# EAGLE board Mainboard v13 (EAGLE 9.4.2)
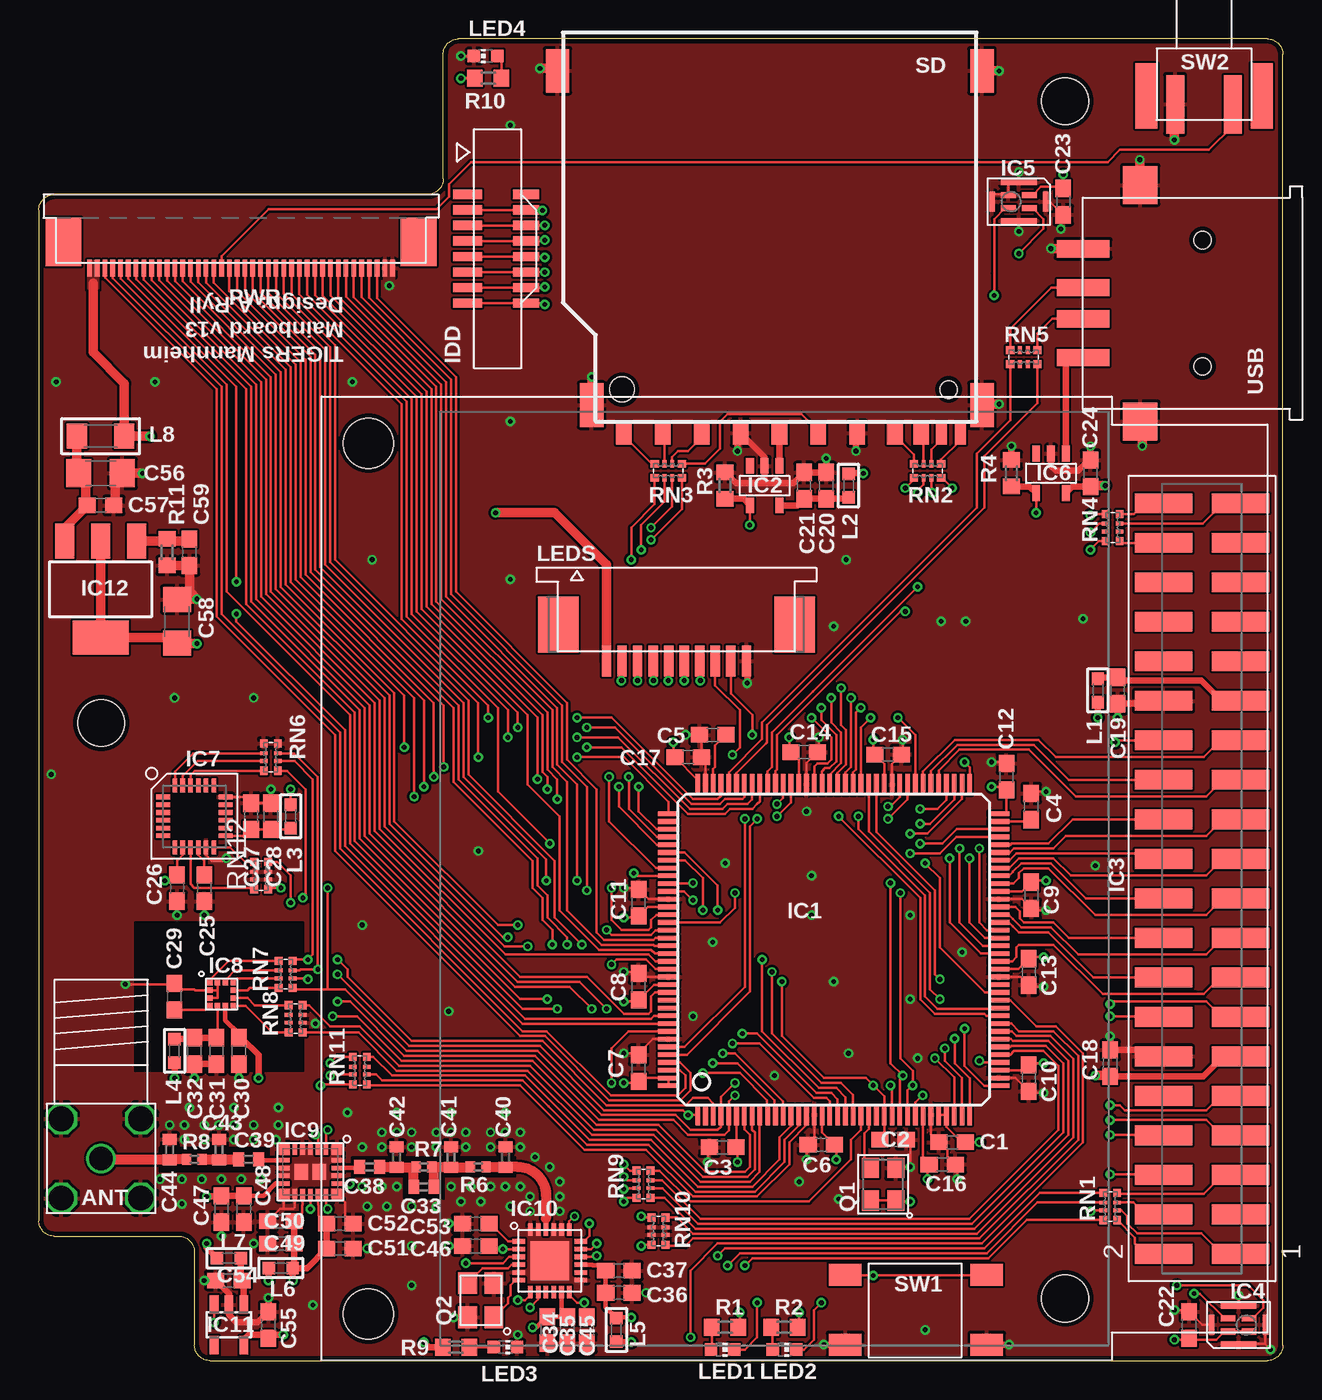
[diagram p4: board, top side]
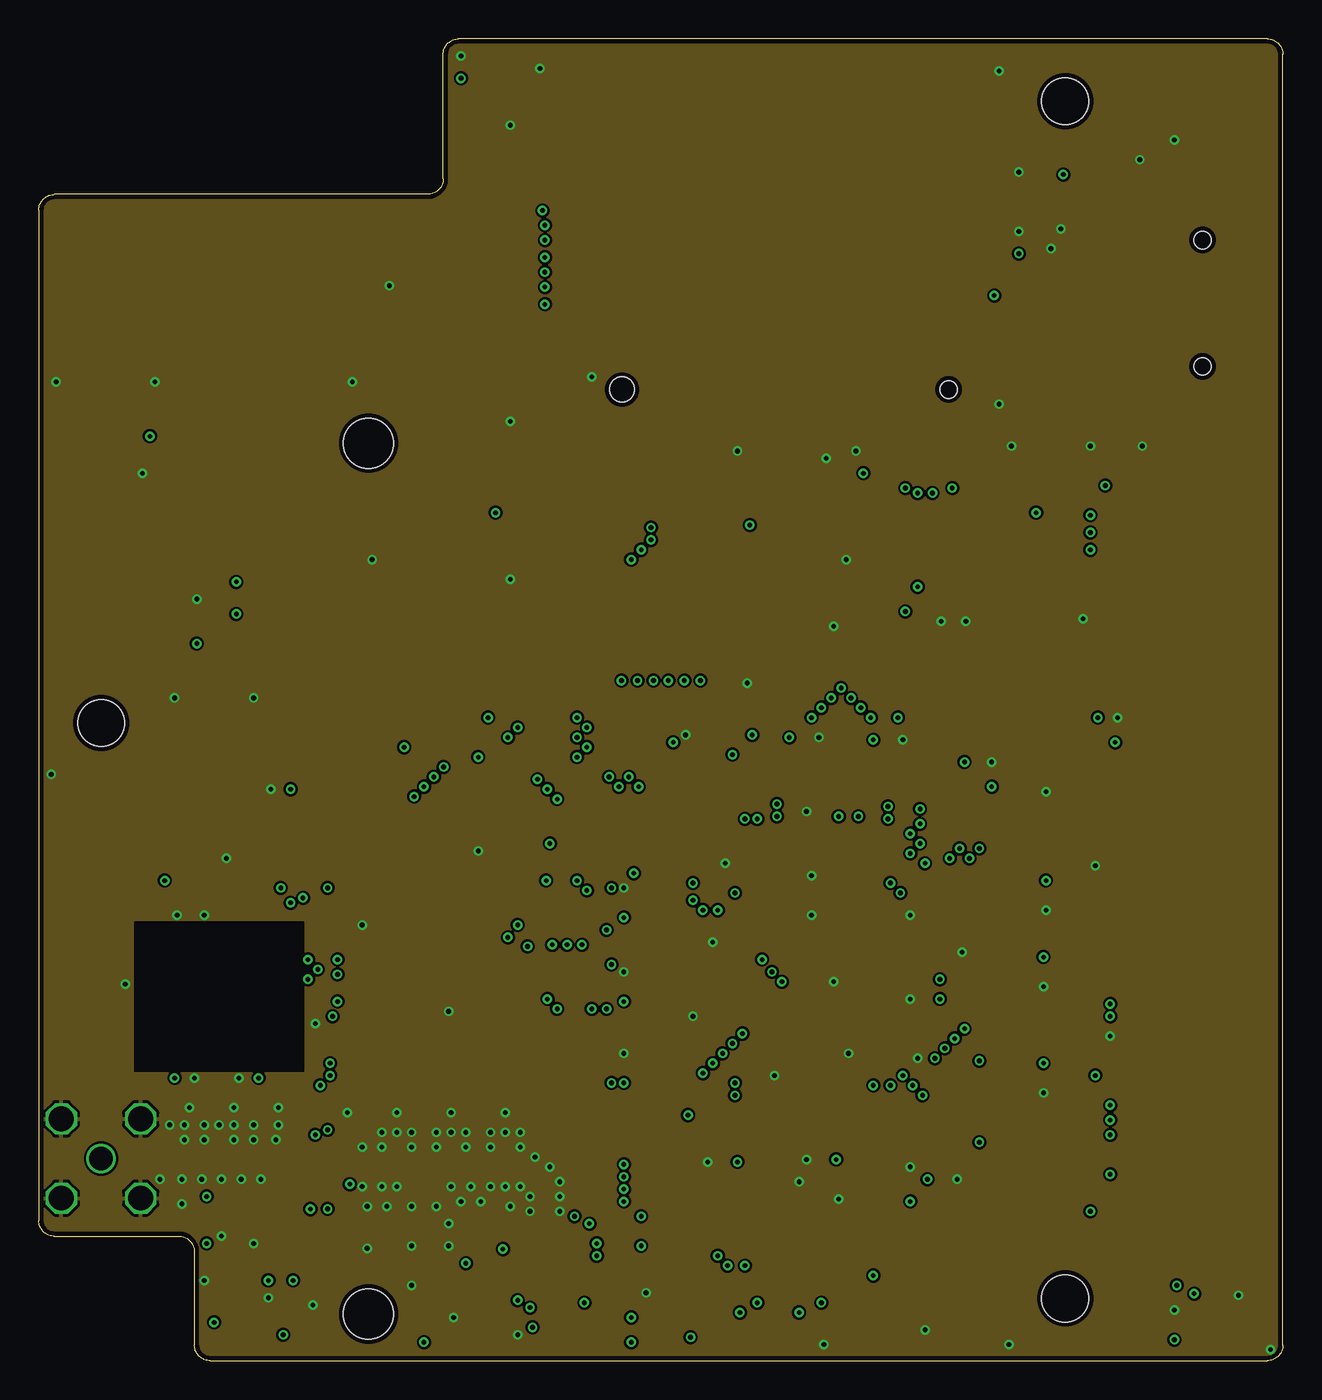
[diagram p5: board, inner layer GND]
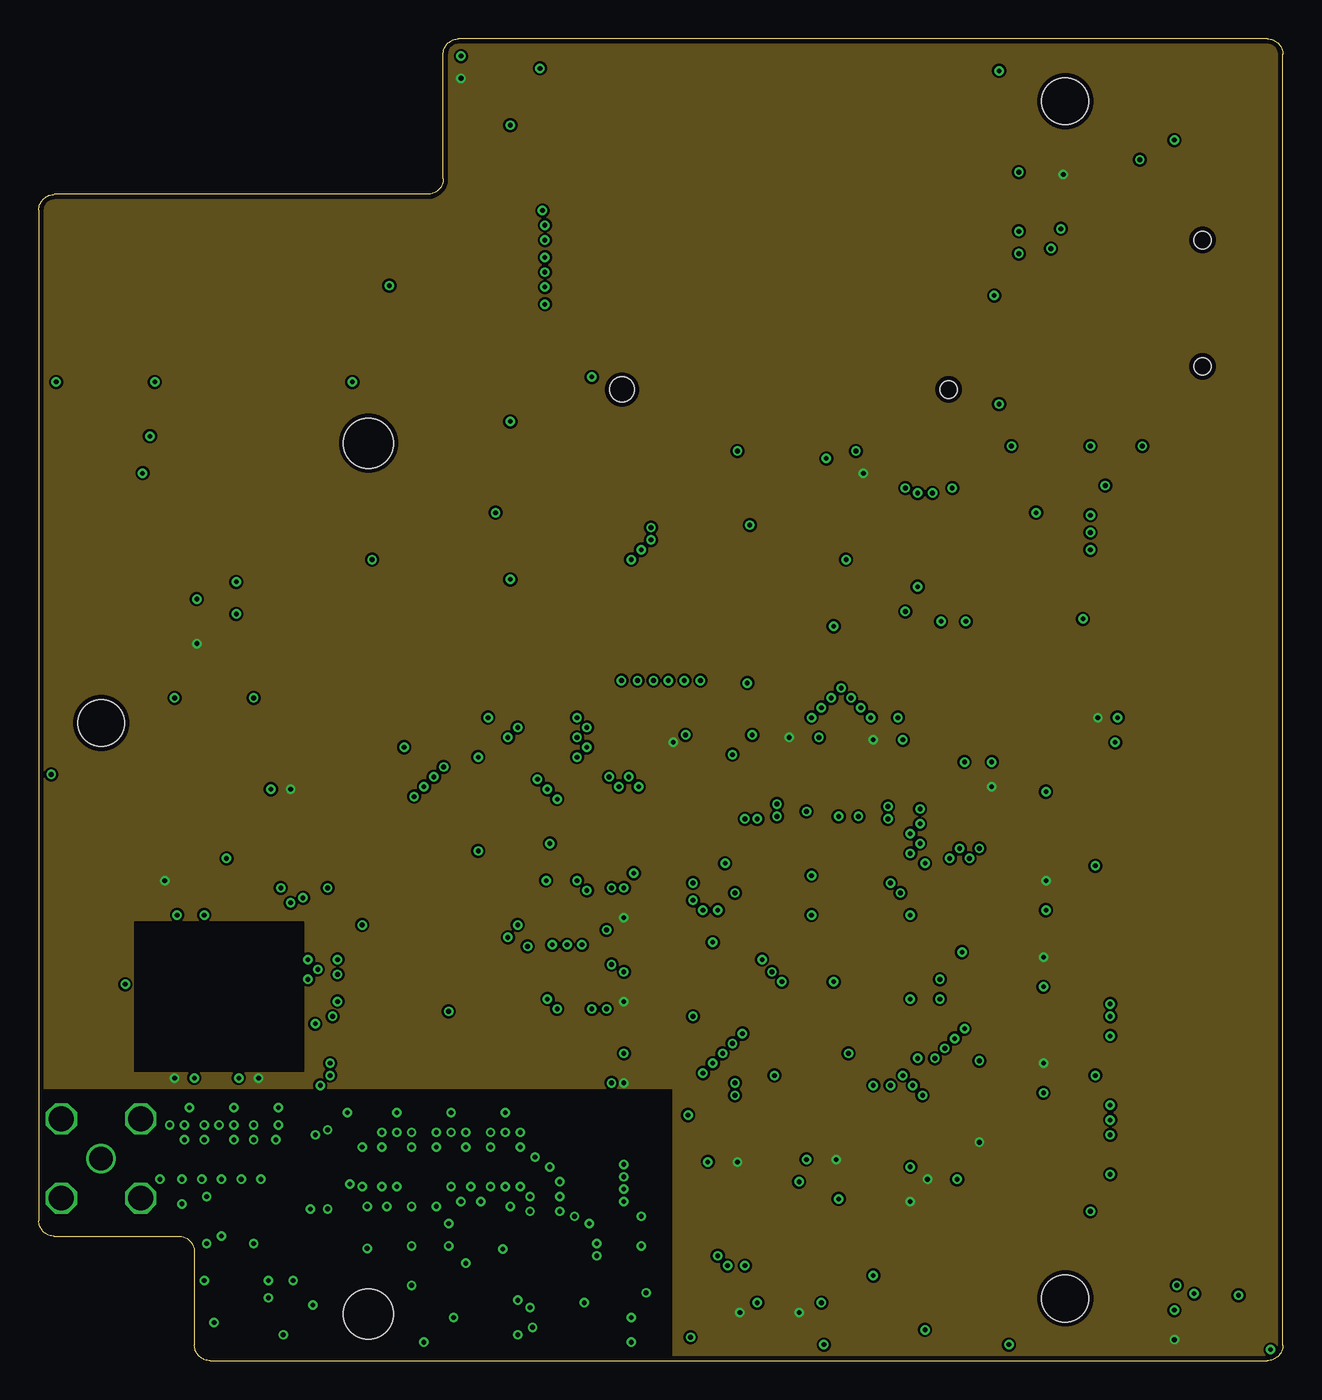
[diagram p6: board, inner layer PWR]
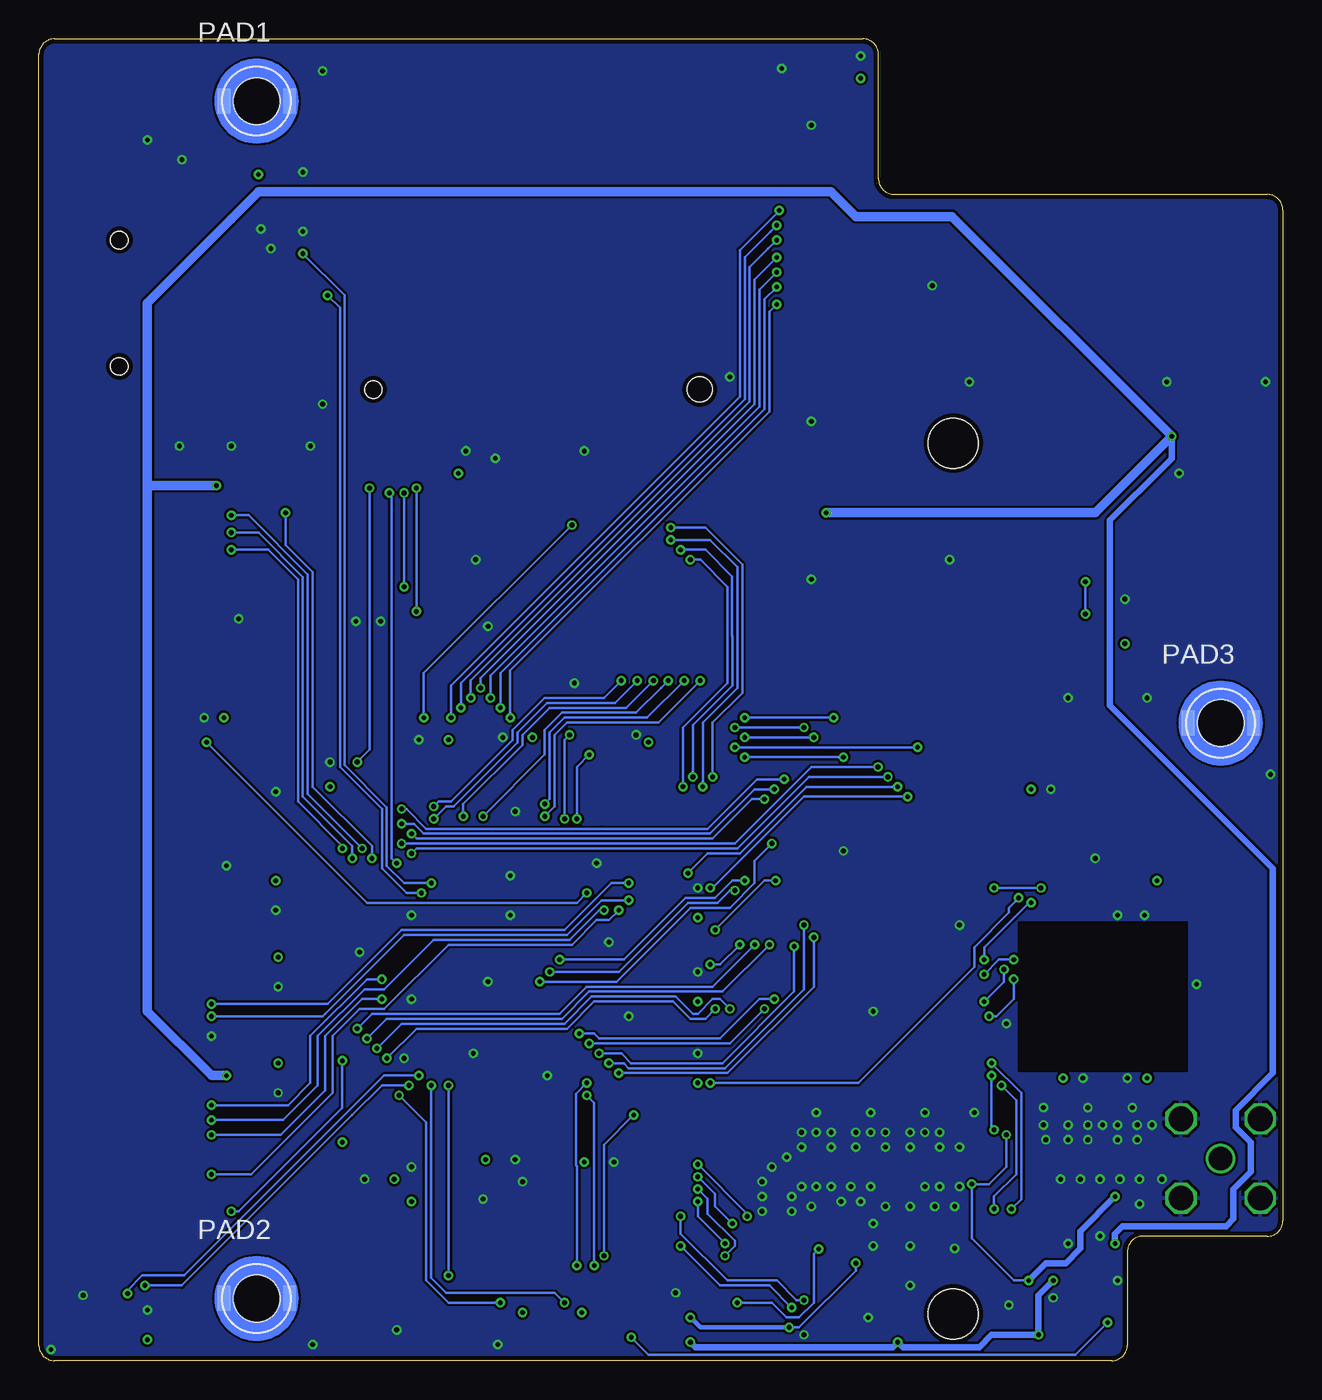
[diagram p7: board, bottom side, seen from below]

Size 80 x 85 mm. Coordinates in mm from the lower left corner, seen from the top.
Outline: 11,0 79,0 arc90 80,1 80,84 arc90 79,85 27,85 arc90 26,84 26,76 arc-90 25,75 1,75 arc90 0,74 0,9 arc90 1,8 9,8 arc-90 10,7 10,1 arc90 11,0
Copper layers (1+2*15+16): Top 0.035mm / dielectric 0.38mm / GND 0.035mm / dielectric 0.71mm / PWR 0.035mm / dielectric 0.38mm / Bottom 0.035mm
Design rules "PCB-POOL Standard_ML4 *": minimum track width 0.15mm, minimum drill 0.3mm, track to track 0.15mm, track to pad 0.15mm, pad to pad 0.15mm, via to via 0.15mm, smd to smd 0.15mm, copper to edge 0.3mm, drill to drill 0.2mm, minimum pad ring 0.2mm, minimum via ring 0.15mm, stop-mask expansion 0.075mm, vias tented up to drill 13mil, thermal gap 0.2mm
Net classes: 1 50Ohm: width 0.643 mm, clearance 0.35 mm

## Footprints (pad centres in the part's own frame; a part is rotated, then mirrored left to right if it is on the bottom)
ANT-SMA-RA = drill 1.5: C 0,0 | drill 1.6 octagon: GND1 -2.55,2.55; GND2 2.55,2.55; GND3 2.55,-2.55; GND4 -2.55,-2.55
C0603 = smd 1.1 x 1: 1 -0.85,0; 2 0.85,0
C0402 = smd 0.7 x 0.9: 1 -0.65,0; 2 0.65,0
C1206 = smd 1.6 x 1.8: 1 -1.4,0; 2 1.4,0
LQFP144-ST = smd 0.3 x 1.35: 1 -8.75,-10.625; 2 -8.25,-10.625; 3 -7.75,-10.625; 4 -7.25,-10.625; 5 -6.75,-10.625; 6 -6.25,-10.625; 7 -5.75,-10.625; 8 -5.25,-10.625; 9 -4.75,-10.625; 10 -4.25,-10.625; 11 -3.75,-10.625; 12 -3.25,-10.625; 13 -2.75,-10.625; 14 -2.25,-10.625; 15 -1.75,-10.625; 16 -1.25,-10.625; 17 -0.75,-10.625; 18 -0.25,-10.625; 19 0.25,-10.625; 20 0.75,-10.625; 21 1.25,-10.625; 22 1.75,-10.625; 23 2.25,-10.625; 24 2.75,-10.625; 25 3.25,-10.625; 26 3.75,-10.625; 27 4.25,-10.625; 28 4.75,-10.625; 29 5.25,-10.625; 30 5.75,-10.625; 31 6.25,-10.625; 32 6.75,-10.625; 33 7.25,-10.625; 34 7.75,-10.625; 35 8.25,-10.625; 36 8.75,-10.625; 73 8.75,10.625; 74 8.25,10.625; 75 7.75,10.625; 76 7.25,10.625; 77 6.75,10.625; 78 6.25,10.625; 79 5.75,10.625; 80 5.25,10.625; 81 4.75,10.625; 82 4.25,10.625; 83 3.75,10.625; 84 3.25,10.625; 85 2.75,10.625; 86 2.25,10.625; 87 1.75,10.625; 88 1.25,10.625; 89 0.75,10.625; 90 0.25,10.625; 91 -0.25,10.625; 92 -0.75,10.625; 93 -1.25,10.625; 94 -1.75,10.625; 95 -2.25,10.625; 96 -2.75,10.625; 97 -3.25,10.625; 98 -3.75,10.625; 99 -4.25,10.625; 100 -4.75,10.625; 101 -5.25,10.625; 102 -5.75,10.625; 103 -6.25,10.625; 104 -6.75,10.625; 105 -7.25,10.625; 106 -7.75,10.625; 107 -8.25,10.625; 108 -8.75,10.625 | smd 1.35 x 0.3: 37 10.625,-8.75; 38 10.625,-8.25; 39 10.625,-7.75; 40 10.625,-7.25; 41 10.625,-6.75; 42 10.625,-6.25; 43 10.625,-5.75; 44 10.625,-5.25; 45 10.625,-4.75; 46 10.625,-4.25; 47 10.625,-3.75; 48 10.625,-3.25; 49 10.625,-2.75; 50 10.625,-2.25; 51 10.625,-1.75; 52 10.625,-1.25; 53 10.625,-0.75; 54 10.625,-0.25; 55 10.625,0.25; 56 10.625,0.75; 57 10.625,1.25; 58 10.625,1.75; 59 10.625,2.25; 60 10.625,2.75; 61 10.625,3.25; 62 10.625,3.75; 63 10.625,4.25; 64 10.625,4.75; 65 10.625,5.25; 66 10.625,5.75; 67 10.625,6.25; 68 10.625,6.75; 69 10.625,7.25; 70 10.625,7.75; 71 10.625,8.25; 72 10.625,8.75; 109 -10.625,8.75; 110 -10.625,8.25; 111 -10.625,7.75; 112 -10.625,7.25; 113 -10.625,6.75; 114 -10.625,6.25; 115 -10.625,5.75; 116 -10.625,5.25; 117 -10.625,4.75; 118 -10.625,4.25; 119 -10.625,3.75; 120 -10.625,3.25; 121 -10.625,2.75; 122 -10.625,2.25; 123 -10.625,1.75; 124 -10.625,1.25; 125 -10.625,0.75; 126 -10.625,0.25; 127 -10.625,-0.25; 128 -10.625,-0.75; 129 -10.625,-1.25; 130 -10.625,-1.75; 131 -10.625,-2.25; 132 -10.625,-2.75; 133 -10.625,-3.25; 134 -10.625,-3.75; 135 -10.625,-4.25; 136 -10.625,-4.75; 137 -10.625,-5.25; 138 -10.625,-5.75; 139 -10.625,-6.25; 140 -10.625,-6.75; 141 -10.625,-7.25; 142 -10.625,-7.75; 143 -10.625,-8.25; 144 -10.625,-8.75
SOT23-5 = smd 1.016 x 0.508: 1 -1.27,0.953; 2 -1.27,0; 3 -1.27,-0.953; 4 1.27,-0.953; 5 1.27,0.953
LT24 = smd 1.27 x 3.683: 1 24.13,2.477; 2 24.13,-2.477; 3 21.59,2.477; 4 21.59,-2.477; 5 19.05,2.477; 6 19.05,-2.477; 7 16.51,2.477; 8 16.51,-2.477; 9 13.97,2.477; 10 13.97,-2.477; 11 11.43,2.477; 12 11.43,-2.477; 13 8.89,2.477; 14 8.89,-2.477; 15 6.35,2.477; 16 6.35,-2.477; 17 3.81,2.477; 18 3.81,-2.477; 19 1.27,2.477; 20 1.27,-2.477; 21 -1.27,2.477; 22 -1.27,-2.477; 23 -3.81,2.477; 24 -3.81,-2.477; 25 -6.35,2.477; 26 -6.35,-2.477; 27 -8.89,2.477; 28 -8.89,-2.477; 29 -11.43,2.477; 30 -11.43,-2.477; 31 -13.97,2.477; 32 -13.97,-2.477; 33 -16.51,2.477; 34 -16.51,-2.477; 35 -19.05,2.477; 36 -19.05,-2.477; 37 -21.59,2.477; 38 -21.59,-2.477; 39 -24.13,2.477; 40 -24.13,-2.477 | hole 3.2: -28,-53.6; 28,-53.6
HCLGA4 = smd 0.4 x 0.95: 1 0.425,-0.675; 2 0.425,0.675; 3 -0.425,0.675; 4 -0.425,-0.675 | smd 1.3 x 0.35: G1 0,1.725; G4 0,-1.725 | smd 0.35 x 2.3: G2 -1.225,0; G3 1.225,0
QFN24-4X4-P = smd 0.9 x 0.3: 1 -2,1.25; 2 -2,0.75; 3 -2,0.25; 4 -2,-0.25; 5 -2,-0.75; 6 -2,-1.25; 13 2,-1.25; 14 2,-0.75; 15 2,-0.25; 16 2,0.25; 17 2,0.75; 18 2,1.25 | smd 0.3 x 0.9: 7 -1.25,-2; 8 -0.75,-2; 9 -0.25,-2; 10 0.25,-2; 11 0.75,-2; 12 1.25,-2; 19 1.25,2; 20 0.75,2; 21 0.25,2; 22 -0.25,2; 23 -0.75,2; 24 -1.25,2
VFLGA-12 = smd 0.35 x 0.35: 1 -0.75,0.75; 2 -0.75,0.25; 3 -0.75,-0.25; 4 -0.75,-0.75; 5 -0.25,-0.75; 6 0.25,-0.75; 7 0.75,-0.75; 8 0.75,-0.25; 9 0.75,0.25; 10 0.75,0.75; 11 0.25,0.75; 12 -0.25,0.75
SMCM-22 = smd 0.75 x 0.75: 1 -1.475,1.725; 7 -1.475,-1.725; 12 1.475,-1.725; 18 1.475,1.725 | smd 0.75 x 0.3: 2 -1.475,1; 3 -1.475,0.5; 4 -1.475,0; 5 -1.475,-0.5; 6 -1.475,-1; 13 1.475,-1; 14 1.475,-0.5; 15 1.475,0; 16 1.475,0.5; 17 1.475,1 | smd 0.3 x 0.75: 8 -0.75,-1.725; 9 -0.25,-1.725; 10 0.25,-1.725; 11 0.75,-1.725; 19 0.75,1.725; 20 0.25,1.725; 21 -0.25,1.725; 22 -0.75,1.725 | smd 1 x 0.85: PAD1 0,0.575; PAD2 0,-0.575
QFN24L = smd 0.8 x 0.3: 1 -2,1.25; 2 -2,0.75; 3 -2,0.25; 4 -2,-0.25; 5 -2,-0.75; 6 -2,-1.25; 13 2,-1.25; 14 2,-0.75; 15 2,-0.25; 16 2,0.25; 17 2,0.75; 18 2,1.25 | smd 0.3 x 0.8: 7 -1.25,-2; 8 -0.75,-2; 9 -0.25,-2; 10 0.25,-2; 11 0.75,-2; 12 1.25,-2; 19 1.25,2; 20 0.75,2; 21 0.25,2; 22 -0.25,2; 23 -0.75,2; 24 -1.25,2 | smd 2.5 x 2.5: PAD 0,0
SOT23-5L = smd 0.55 x 1.2: 1 -0.95,-1.3; 2 0,-1.3; 3 0.95,-1.3; 4 0.95,1.3; 5 -0.95,1.3
SOT223 = smd 1.219 x 2.235: 1 -2.311,-3.099; 2 0,-3.099; 3 2.311,-3.099 | smd 3.6 x 2.2: 4 0,3.099
TE-1734248-8 = smd 0.6 x 1.85: A1 3.5,1.925; A2 2.5,1.925; A3 1.5,1.925; A4 0.5,1.925; A5 -0.5,1.925; A6 -1.5,1.925; A7 -2.5,1.925; A8 -3.5,1.925 | smd 0.6 x 1.65: B1 3.5,-1.825; B2 2.5,-1.825; B3 1.5,-1.825; B4 0.5,-1.825; B5 -0.5,-1.825; B6 -1.5,-1.825; B7 -2.5,-1.825; B8 -3.5,-1.825
L0603 = smd 0.8 x 0.8: 1 -0.762,0; 2 0.762,0
L1206 = smd 1.3 x 1.6: 1 -1.524,0; 2 1.524,0
CHIP-LED0603 = smd 0.8 x 0.8: A 0,-0.75; C 0,0.75
TE-1-84952-0 = smd 0.6 x 2: 1 -4.5,-6; 2 -3.5,-6; 3 -2.5,-6; 4 -1.5,-6; 5 -0.5,-6; 6 0.5,-6; 7 1.5,-6; 8 2.5,-6; 9 3.5,-6; 10 4.5,-6 | smd 2.6 x 3.6: G1 -7.6,-3.65; G2 7.6,-3.65
5,4/3,0 = smd 0.8 x 1.6: 1 -2.1,0; 2 2.1,0 | hole 3: 0,0
TE-4-1734592-0 = smd 0.3 x 1.1: 1 -9.75,-4.75; 2 -9.25,-4.75; 3 -8.75,-4.75; 4 -8.25,-4.75; 5 -7.75,-4.75; 6 -7.25,-4.75; 7 -6.75,-4.75; 8 -6.25,-4.75; 9 -5.75,-4.75; 10 -5.25,-4.75; 11 -4.75,-4.75; 12 -4.25,-4.75; 13 -3.75,-4.75; 14 -3.25,-4.75; 15 -2.75,-4.75; 16 -2.25,-4.75; 17 -1.75,-4.75; 18 -1.25,-4.75; 19 -0.75,-4.75; 20 -0.25,-4.75; 21 0.25,-4.75; 22 0.75,-4.75; 23 1.25,-4.75; 24 1.75,-4.75; 25 2.25,-4.75; 26 2.75,-4.75; 27 3.25,-4.75; 28 3.75,-4.75; 29 4.25,-4.75; 30 4.75,-4.75; 31 5.25,-4.75; 32 5.75,-4.75; 33 6.25,-4.75; 34 6.75,-4.75; 35 7.25,-4.75; 36 7.75,-4.75; 37 8.25,-4.75; 38 8.75,-4.75; 39 9.25,-4.75; 40 9.75,-4.75 | smd 2.3 x 3.1: P1 -11.42,-3.05; P2 11.42,-3.05
OSCI-ASE = smd 1.3 x 1.1: 1 -1.05,-0.825; 2 1.05,-0.825; 3 1.05,0.825; 4 -1.05,0.825
CRYSTAL-7M = smd 1.4 x 1.2: 1 -1.1,-0.85; 2 1.1,-0.85; 3 1.1,0.85; 4 -1.1,0.85
R0603 = smd 1 x 1.1: 1 -0.85,0; 2 0.85,0
R0402 = smd 0.6 x 0.7: 1 -0.5,0; 2 0.5,0
EXB28V = smd 0.525 x 0.5: 1 -0.875,-0.45; 4 0.875,-0.45; 5 0.875,0.45; 8 -0.875,0.45 | smd 0.25 x 0.5: 2 -0.25,-0.45; 3 0.25,-0.45; 6 0.25,0.45; 7 -0.25,0.45
SDCARD = smd 1 x 1.5: 1 6.875,0.75; 2 4.375,0.75; 3 1.875,0.75; 4 -0.625,0.75; 5 -3.125,0.75; 6 -5.625,0.75; 7 -8.05,0.75; 8 -9.75,0.75; 9 9.375,0.75 | smd 0.7 x 1.5: CD -11.05,0.75; WP -12.25,0.75 | smd 1.5 x 2.8: COM1 -13.65,-1.05; COM2 11.45,-1.05; COM3 -13.65,-22.55; COM4 13.65,-22.55 | hole 1.1: -11.5,-2.05 | hole 1.6: 9.5,-2.05
BUTTON4 = smd 1.4 x 2.1: 1 4.5,9.1; 2 4.5,0; 3 0,9.1; 4 0,0
KT11 = smd 3.759 x 1.168: 1 3.581,1.854; 2 3.581,-1.854 | smd 4.191 x 1.422: MNT1 3.048,3.708; MNT2 3.048,-3.708
USBA-TE = smd 1.12 x 3.39: 1 -3.5,0; 2 -1,0; 3 1,0; 4 3.5,0 | smd 2.44 x 2.22: MNT1 -7.6,-3.68; MNT2 7.6,-3.68 | hole 1.1: -4.06,-7.68; 4.06,-7.68

## Placement (x,y rotation side)
ANT  [ANT-SMA-RA]  4,13 180 top
C1  100n  [C0603]  58.74,14.05 180 top
C2  100n  [C0603]  54.93,14.2 0 top
C3  100n  [C0603]  43.97,13.73 180 top
C4  10u  [C0603]  63.82,35.63 90 top
C5  10u  [C0603]  43.34,40.24 180 top
C6  100n  [C0603]  50.32,13.89 180 top
C7  100n  [C0603]  38.58,18.81 90 top
C8  100n  [C0603]  38.58,24.05 90 top
C9  100n  [C0603]  63.82,29.92 270 top
C10  100n  [C0603]  63.66,18.17 270 top
C11  100n  [C0603]  38.58,29.44 90 top
C12  100n  [C0603]  62.23,37.54 90 top
C13  100n  [C0603]  63.66,25 270 top
C14  100n  [C0603]  49.21,39.13 0 top
C15  100n  [C0603]  54.61,38.97 0 top
C16  100n  [C0603]  58.1,12.62 0 top
C17  100n  [C0603]  41.75,38.81 0 top
C18  100n  [C0603]  68.9,19.12 90 top
C19  100n  [C0603]  69.37,43.1 270 top
C20  10u  [C0603]  50.64,56.27 90 top
C21  100n  [C0603]  49.21,56.27 90 top
C22  10u  [C0603]  73.98,2.3 90 top
C23  10u  [C0603]  65.88,74.53 270 top
C24  100n  [C0603]  67.63,57.07 90 top
C25  10u  [C0603]  10.63,30.4 270 top
C26  100n  [C0603]  8.89,30.4 270 top
C27  100n  [C0603]  13.65,35 90 top
C28  10u  [C0603]  14.92,35 90 top
C29  100n  [C0603]  8.73,23.41 90 top
C30  100n  [C0603]  12.86,19.92 270 top
C31  100n  [C0603]  11.43,19.92 270 top
C32  10u  [C0603]  10,19.92 270 top
C33  0p5  [C0402]  24.76,11.19 180 top
C34  100n  [C0603]  32.7,1.98 270 top
C35  1n  [C0603]  33.97,1.98 270 top
C36  100n  [C0603]  37.3,4.36 0 top
C37  1n  [C0603]  37.3,5.79 0 top
C38  100p  [C0402]  21.27,12.46 180 top
C39  47p  [C0402]  13.49,12.93 180 top
C40  0p8  [C0402]  30,13.09 90 top
C41  1p5  [C0402]  26.51,13.09 90 top
C42  NA  [C0402]  23.02,13.09 90 top
C43  0p6  [C0402]  11.59,13.57 90 top
C44  NA  [C0402]  8.41,13.57 90 top
C45  1u  [C0603]  35.24,1.98 270 top
C46  10n  [C0603]  28.1,7.38 180 top
C47  100n  [C0603]  11.75,9.76 270 top
C48  1n  [C0603]  13.18,9.76 270 top
C49  100n  [C0603]  15.56,7.54 180 top
C50  1n  [C0603]  15.56,8.96 180 top
C51  100n  [C0603]  19.37,7.22 0 top
C52  1n  [C0603]  19.37,8.81 0 top
C53  10n  [C0603]  28.1,8.81 180 top
C54  10u  [C0603]  12.22,5.16 180 top
C55  10u  [C0603]  14.76,2.3 90 top
C56  33u  [C1206]  3.97,57.07 0 top
C57  100n  [C0603]  3.97,55 0 top
C58  33u  [C1206]  8.89,47.54 90 top
C59  100n  [C0603]  9.68,51.99 270 top
IC1  STM32H743ZST  [LQFP144-ST]  51.12,26.43 0 top
IC2  STMPS2151STR  [SOT23-5]  46.67,56.27 270 top
IC3  LT24  [LT24]  74.8,31 270 top
IC4  MP34DT05  [HCLGA4]  77.15,2.3 270 top
IC5  MP34DT05  [HCLGA4]  63.02,74.53 90 top
IC6  STMPS2151STR  [SOT23-5]  65.09,57.07 270 top
IC7  ICM-20689  [QFN24-4X4-P]  10,35 0 top
IC8  LIS3MDL  [VFLGA-12]  11.75,23.57 0 top
IC9  SKY66112  [SMCM-22]  17.46,12.14 270 top
IC10  SX1280  [QFN24L]  32.86,6.43 0 top
IC11  LP5907MFX-3.3  [SOT23-5L]  12.22,2.3 180 top
IC12  LT3080ST  [SOT223]  3.97,49.61 180 top
IDD  [TE-1734248-8]  29.5,71.5 90 top
L1  120R  [L0603]  68.1,43.1 270 top
L2  120R  [L0603]  52.07,56.27 90 top
L3  120R  [L0603]  16.19,35 90 top
L4  120R  [L0603]  8.73,19.92 270 top
L5  120R  [L0603]  37.15,1.98 90 top
L6  120R  [L0603]  15.56,5.95 0 top
L7  120R  [L0603]  12.22,6.58 180 top
L8  470R  [L1206]  3.97,59.45 180 top
LED1  gr  [CHIP-LED0603]  43.97,0.71 270 top
LED2  rd  [CHIP-LED0603]  47.94,0.71 270 top
LED3  gr  [CHIP-LED0603]  30,0.87 270 top
LED4  gr  [CHIP-LED0603]  28.73,83.9 90 top
LEDS  [TE-1-84952-0]  41,51 0 top
PAD1  [5,4/3,0]  66,81 0 bottom
PAD2  [5,4/3,0]  66,4 0 bottom
PAD3  [5,4/3,0]  4,41 0 bottom
PWR  4-1734742-0  [TE-4-1734592-0]  13,75 0 top
Q1  ASE-4.000MHZ-LC-T  [OSCI-ASE]  54.29,11.35 90 top
Q2  FL520WFMT1  [CRYSTAL-7M]  28.41,3.89 90 top
R1  1k  [R0603]  44.13,2.14 0 top
R2  1k  [R0603]  47.94,2.14 0 top
R3  10k  [R0603]  44.13,56.27 90 top
R4  10k  [R0603]  62.55,57.07 270 top
R6  3n  [R0402]  28.26,12.46 180 top
R7  2n7  [R0402]  24.76,12.46 180 top
R8  3n9  [R0402]  10,12.93 180 top
R9  1k  [R0603]  26.83,0.87 180 top
R10  1k  [R0603]  28.89,82.47 180 top
R11  330k  [R0603]  8.25,51.99 90 top
RN1  100  [EXB28V]  68.9,9.92 90 top
RN2  100  [EXB28V]  57.15,57.23 0 top
RN3  100  [EXB28V]  40.48,57.23 0 top
RN4  100  [EXB28V]  69.06,53.57 90 top
RN5  100  [EXB28V]  63.34,64.53 0 top
RN6  100  [EXB28V]  14.92,38.81 90 top
RN7  100  [EXB28V]  15.87,24.84 90 top
RN8  100  [EXB28V]  16.51,21.98 90 top
RN9  100  [EXB28V]  38.89,11.35 90 top
RN10  100  [EXB28V]  39.84,8.33 90 top
RN11  100  [EXB28V]  20.64,18.65 90 top
RN12  100  [EXB28V]  14.29,31.19 90 top
SD  SDCARD  [SDCARD]  47,60.4 180 top
SW1  KT11P4SA3M  [BUTTON4]  60.96,1.03 90 top
SW2  KT11P4SA3M  [KT11]  74.93,84.37 270 top
USB  [USBA-TE]  67.15,68 90 top

## Tracks (layer width: path | path; a pad name or v marks a point on that pad's centre or on a via)
+3V3  (via drill 0.3)
  Top 0.152: v8.1,30.87 8.52,30.87 C26.1 8.89,32.14 9.25,32.5 IC7.8 | IC1.121 39.16,29.18 C11.1 38.47,28.49 v37.62,28.49 | IC1.131 39.56,24.18 C8.1 38.47,23.09 v37.62,23.09 | IC1.144 IC1.143 38.8,18.18 C7.1 38.47,17.86 v37.62,17.86 | IC1.6 44.87,13.77 C3.1 44.92,13.62 v44.92,12.77 | IC1.17 50.37,14.69 C6.1 51.27,13.78 v51.27,12.93 | IC1.30 56.87,13 C16.1 57.15,12.51 v57.15,11.66 | IC1.32 IC1.33 58.37,15.05 59.37,14.05 C1.1 v60.48,14.05 | IC1.39 63.31,18.68 C10.1 63.76,19.12 v64.61,19.12 | IC1.52 62.99,25.18 C13.1 63.76,25.95 v64.61,25.95 | IC1.62 63.22,30.18 C9.1 63.92,30.87 v64.77,30.87 | IC1.72 62.23,35.18 C12.1 62.23,36.91 v61.28,36.91 | IC1.84 54.37,38.36 C15.1 53.66,39.07 v53.66,39.92 | IC1.95 48.87,38.62 48.47,39.02 | 48.47,39.02 C14.1 | v48.26,40.08 48.26,39.23 48.47,39.02 | v40.8,39.76 40.8,38.91 C17.1 42.37,37.34 IC1.108 | Q1.4 Q1.1 55.18,10.23 v56.04,10.23 | IC4.2 IC4.1 76.25,1.87 75.72,1.34 74.08,1.34 C22.1 73.87,1.34 v73.02,1.34 | IC5.1 63.92,74.95 64.45,75.48 65.78,75.48 | 65.78,75.48 C23.1 | v65.88,76.28 65.88,75.58 65.78,75.48 | R1.2 45.08,2.24 v45.08,3.09 | R2.2 48.89,2.24 v48.89,3.09 | L3.2 v16.19,36.75 | v27.14,82.47 R10.2
  Top 0.305: 12,22.34 12,21.89 | C30.1 12.86,21.03 12,21.89 | 12,21.89 IC8.6
  Top 0.406: L2.2 52.1,57.07 v53.02,57.07 | v68.1,41.35 L1.2 | L4.2 v8.73,18.17 | C30.1 13.02,20.77 14.13,19.66 v14.13,18.17
  Top 0.61: IC12.2 IC12.4 8.52,46.51 C58.1 8.92,46.11 v10.16,46.11
  pour PWR: -0.16,85.16 -0.16,17.54 40.8,17.54 40.8,-0.08 80.17,-0.08 80.17,85.16
+5V  (via drill 0.3)
  Top 0.406: C18.1 74.87,18.27 76.17,19.57 IC3.11 | C24.1 66.46,56.22 IC6.5 | L7.2 10.79,7.25 v10.79,7.54
  Top 0.61: 3.49,69.29 3.49,64.84 5.49,62.84 L8.1 v7.14,59.45 | v67.94,18.33 68.84,18.33 C18.1 | C24.1 67.68,56.27 v68.58,56.27 | LEDS.1 36.5,51.2 33.18,54.53 v29.37,54.53
  Bottom 0.406: v10.79,7.54 10.79,8.17 10.32,8.65 3.65,8.65 3.17,9.12 3.17,11.03 2.06,12.14 2.06,14.05 3.01,15 3.01,16.11 0.63,18.49 0.63,31.67 11.11,42.14 11.11,54.05 7.62,57.54 7.14,58.02 v7.14,59.45
  Bottom 0.61: 73.02,56.27 73.02,68.02 67.63,73.42 65.88,75.16 29.05,75.16 27.46,73.58 21.27,73.58 v7.14,59.45 12.06,54.53 v29.37,54.53 | 73.02,56.27 73.02,22.46 68.9,18.33 v67.94,18.33 | v68.58,56.27 73.02,56.27
  pour Top (no thermals): 3.17,70.72 3.81,70.72 3.81,68.97 3.17,68.97
BTN
  Top 0.152: SW2.1 76.78,79.4 75.25,77.86 69.53,77.86 68.74,77.07 27.78,77.07 26.38,75.66 26.38,74.84 25.59,74.05 14.76,74.05 11.75,71.04 11.75,71.03 PWR.18
CPS  (via drill 0.3)
  Top 0.152: IC9.15 v17.46,9.75 | RN11.5 19.13,19.52 v18.73,19.12
  Bottom 0.152: v18.73,19.12 16.83,17.22 16.83,10.38 v17.46,9.75
CRX  (via drill 0.3)
  Top 0.152: IC9.2 18.46,14.73 v18.57,14.84 | RN11.7 18.8,18.4 v18.73,18.33
  Bottom 0.152: v18.57,14.84 18.73,15 v18.73,18.33
CTX  (via drill 0.3)
  Top 0.152: IC9.17 18.46,10.03 18.57,9.92 v18.57,9.76 | RN11.8 18.17,17.77 v18.1,17.7
  Bottom 0.152: v18.57,9.76 18.57,10.55 17.14,11.98 17.14,16.74 v18.1,17.7
DFSDM-CKOUT  (via drill 0.3)
  Top 0.152: IC1.28 55.87,17.37 v56.2,17.7 56.2,18.65 55.4,19.44 v55.4,30.08 | IC4.3 78.05,2.72 78.74,3.41 78.74,3.89 77.79,4.84 v73.18,4.84 | IC5.3 62.12,74.1 61.44,73.42 61.44,69.92 v61.44,68.5
  Bottom 0.152: v56.2,17.7 57.94,17.7 59.85,15.79 70.8,4.84 v73.18,4.84 | v55.4,30.08 56.35,30.08 57.94,31.67 57.94,35.48 60.64,38.17 60.64,67.7 v61.44,68.5
DFSDM-DATIN0  (via drill 0.3)
  Top 0.152: IC1.27 55.37,18.14 v55.56,18.33 54.77,19.12 v54.77,30.71 | IC4.4 76.25,2.72 74.66,4.31 v74.29,4.31 | IC5.4 63.92,74.1 64.61,73.42 64.61,72.78 v63.02,71.19
  Bottom 0.152: v55.56,18.33 57.78,18.33 70.64,5.47 73.34,5.47 74.29,4.52 v74.29,4.31 | v54.77,30.71 56.51,30.71 57.62,31.82 57.62,35.59 60.34,38.3 60.34,68.51 v63.02,71.19
FMC-A7
  Top 0.152: IC1.53 62.59,25.68 62.86,25.95 62.86,26.59 63.02,26.74 65.25,26.74 68.42,23.57 74.45,23.57 74.93,23.57 76.01,24.65 IC3.15
FMC-D0  (via drill 0.3)
  Top 0.152: v68.9,16.43 69.53,16.43 69.85,16.11 75.09,16.11 76.01,17.03 IC3.9 | IC1.85 53.87,34 57.62,30.24 57.62,24.84 v57.94,24.52
  Bottom 0.152: v57.94,24.52 58.9,24.52 62.55,20.87 62.55,17.86 63.98,16.43 v68.9,16.43
FMC-D1  (via drill 0.3)
  Top 0.152: v68.9,14.52 72.29,14.52 IC3.8 | IC1.86 53.37,34.02 57.31,30.08 57.31,23.89 v57.94,23.25
  Bottom 0.152: v57.94,23.25 59.21,23.25 61.59,20.87 61.59,17.38 64.45,14.52 v68.9,14.52
FMC-D2  (via drill 0.3)
  Top 0.152: IC1.114 41.53,32.68 43.66,30.55 v43.66,28.97 | v68.9,15.47 75.09,15.47 76.07,14.49 IC3.7
  Bottom 0.152: v68.9,15.47 64.29,15.47 62.07,17.7 62.07,20.87 59.05,23.89 57.78,23.89 54.61,27.06 45.88,27.06 43.97,28.97 v43.66,28.97
FMC-D3  (via drill 0.3)
  Top 0.152: IC1.115 41.56,32.18 42.7,31.03 v42.7,28.97 | v68.9,11.98 72.29,11.98 IC3.6
  Bottom 0.152: v68.9,11.98 66.36,11.98 61.12,17.22 61.12,20.87 59.37,22.62 57.78,22.62 53.66,26.74 45.72,26.74 44.13,28.33 43.34,28.33 v42.7,28.97
FMC-D4
  Top 0.152: IC1.58 62.39,28.18 62.64,27.92 63.02,27.54 64.93,27.54 67.82,24.65 IC3.16
FMC-D5
  Top 0.152: IC3.17 76.17,27.19 75.09,26.11 66.83,26.11 65.09,27.86 63.18,27.86 62.64,28.39 62.64,28.42 62.39,28.68 IC1.59
FMC-D6
  Top 0.152: IC1.60 62.81,29.18 63.09,28.9 63.09,28.43 63.34,28.18 63.34,28.17 65.25,28.17 66.23,27.19 IC3.18
FMC-D7
  Top 0.152: IC1.63 62.67,30.68 63.02,31.03 63.02,31.35 63.34,31.67 64.93,31.67 67.94,28.65 75.09,28.65 76.17,29.73 IC3.19
FMC-D8
  Top 0.152: IC1.64 62.39,31.18 62.64,31.43 62.64,31.45 63.18,31.98 65.09,31.98 67.34,29.73 IC3.20
FMC-D9
  Top 0.152: IC1.65 62.4,31.68 63.02,32.3 65.25,32.3 66.36,31.19 75.09,31.19 76.17,32.27 IC3.21
FMC-D10
  Top 0.152: IC1.66 62.42,32.18 62.86,32.62 71.97,32.62 IC3.22
FMC-D11
  Top 0.152: IC1.67 62.45,32.68 62.7,32.94 65.25,32.94 66.04,33.73 75.09,33.73 76.17,34.81 IC3.23
FMC-D12
  Top 0.152: IC1.68 62.47,33.18 62.55,33.25 64.93,33.25 66.48,34.81 IC3.24
FMC-D13
  Top 0.152: IC1.77 57.87,37.94 59.21,39.29 63.66,39.29 66.67,36.27 75.09,36.27 76.17,37.35 IC3.25
FMC-D14
  Top 0.152: IC1.78 57.37,37.92 59.05,39.6 63.98,39.6 66.23,37.35 IC3.26
FMC-D15
  Top 0.152: IC1.79 56.87,37.89 58.9,39.92 64.29,39.92 65.4,38.81 74.93,38.81 76.01,39.89 IC3.27
FMC-NE1  (via drill 0.3)
  Top 0.152: IC1.123 41.91,28.18 43.82,28.18 44.77,29.13 v44.77,30.08 | v69.21,39.76 69.34,39.89 IC3.28
  Bottom 0.152: v69.21,39.76 58.9,29.44 45.4,29.44 v44.77,30.08
FMC-NOE  (via drill 0.3)
  Top 0.152: IC1.118 42.03,30.68 v42.07,30.71 | v68.9,22.94 69.06,23.09 75.09,23.09 76.07,22.11 IC3.13
  Bottom 0.152: v42.07,30.71 43.18,30.71 46.2,27.7 56.67,27.7 61.44,22.94 v68.9,22.94
FMC-NWE  (via drill 0.3)
  Top 0.152: IC1.119 41.49,30.18 v42.07,29.6 | v68.9,22.14 72.29,22.14 IC3.14
  Bottom 0.152: v42.07,29.6 43.81,29.6 46.04,27.38 56.51,27.38 61.59,22.3 61.75,22.14 68.1,22.14 v68.9,22.14
GND  (via drill 0.3)
  Top 0.152: C26.2 v8.89,28.65 | IC1.120 39.19,29.68 C11.2 38.47,30.4 v37.62,30.4 | IC1.130 38.79,24.68 C8.2 38.47,25 v37.62,25 | v37.62,19.76 38.47,19.76 C7.2 38.58,19.76 39.49,20.68 IC1.138 | C3.2 43.02,13.62 v43.02,12.77 | IC1.16 49.87,14.28 C6.2 49.37,13.78 v49.37,12.93 | v59.05,11.66 59.05,12.51 C16.2 58.9,12.62 58.42,13.09 58.42,13.51 C1.2 57.37,14.57 IC1.31 | IC1.38 62.8,18.18 C10.2 63.76,17.22 v64.61,17.22 | IC1.51 63.13,24.68 C13.2 63.76,24.05 v64.61,24.05 | IC1.61 63.21,29.68 C9.2 63.92,28.97 v64.77,28.97 | C4.2 63.92,36.59 v64.77,36.59 | v61.28,38.49 62.23,38.49 C12.2 | IC1.83 54.87,38.38 55.35,38.86 | 55.35,38.86 C15.2 | v55.56,39.92 55.56,39.07 55.35,38.86 | IC1.94 49.37,38.43 49.8,38.86 | 49.8,38.86 C14.2 | v50.16,40.08 50.16,39.23 49.8,38.86 | IC1.107 42.87,38.54 C17.2 42.6,40.13 C5.2 v41.59,40.24 | Q1.2 55.18,12.46 v56.04,12.46 56.04,13.94 C2.2 | IC4.G4 74.83,2.3 C22.2 73.87,3.25 v73.02,3.25 | IC4.G3 78.85,1.07 | 78.85,1.07 v79.22,0.71 | IC4.G1 78.88,1.1 78.85,1.07 | IC4.G2 v77.15,4.2 | IC5.G4 65.03,74.53 65.85,73.71 C23.2 65.72,73.52 v65.72,72.78 | IC5.G1 61.3,75 62.3,75 IC5.2 62.35,75.75 IC5.G3 v63.02,76.43 | IC5.G2 v63.02,72.62 | IC8.12 11.5,23.82 | 11.5,23.82 IC8.2 10.07,23.82 10,23.89 9.1,23.89 C29.2 8.73,24.2 v5.55,24.2 | IC8.3 11.5,23.32 11.5,23.82 | IC7.11 10.75,32.5 11.11,32.14 11.9,32.14 v12.06,32.3 | IC7.18 13.25,36.25 C27.2 C28.2 v14.92,36.75 | IC9.13 16.46,9.87 16.35,9.76 15.71,9.76 | 15.71,9.76 15.5,9.76 C50.2 | IC9.12 15.74,9.78 15.71,9.76 | IC9.18 19.68,10.17 19.68,9.34 C52.2 | C46.2 v26.35,7.38 | C53.2 v26.35,8.81 | v27.14,83.9 LED4.C | C25.2 v10.63,28.65
  Top 0.406: 46.67,56.43 46.67,57.23 | 46.67,57.23 IC2.2 | 46.67,57.23 46.67,58.1 SD.3 44.92,59.45 v44.92,58.5 | 52.62,60 SD.6 52.55,59.57 v52.55,58.5 | v50.64,58.02 C20.2 C21.2 48.52,56.43 46.99,56.43 46.67,56.43 | R3.2 44.82,56.43 46.67,56.43 | v68.9,20.87 C18.2 71.92,19.98 IC3.12 | v69.37,41.35 C19.2 72.14,42.25 IC3.30 | IC6.2 65.09,57.54 65.4,57.23 66.83,57.23 67.52,57.92 C24.2 v67.63,58.81 | R4.1 v62.55,58.81 | v10,18.17 C32.2 C31.2 | v12.86,18.17 C30.2 | v14.76,4.04 C55.2 14.07,2.46 12.7,2.46 12.22,2.93 IC11.2 12.22,4.3 C54.2 v10.63,5.16 | LEDS.10 45.56,44.94 v45.56,43.57 | SW1.4 v62.39,1.03 | SW1.3 v50.48,1.03
  Top 0.61: C58.2 8.92,48.97 v10.16,48.97 9.68,49.45 C59.2 R11.1 | v6.67,57.07 C56.2 4.92,56.62 4.92,55.11 C57.2 | v70.96,58.81 70.96,60.27 USB.MNT1 | USB.MNT2 70.8,75.63 v70.8,77.23 | v73.02,78.5 73.02,80.74 SW2.2 | USB.4 67.14,71.51 v65.09,71.51 | SD.COM3 v61.75,82.94 | SD.COM1 60.71,61.51 v61.75,61.51 | SD.COM2 v35.56,63.26 | SD.COM4 33.2,83.1 v32.23,83.1
  other vias: 13.81,7.54 11.75,8.01 21.11,7.22 26.67,2.77 30.8,1.66 39.05,4.36 9.37,14.2 10.63,14.2 12.54,14.2 13.81,14.2 15.24,14.2 11.59,15.16 10.63,15.16 9.37,15.16 8.41,15.16 12.54,15.16 9.21,11.66 7.78,11.66 10.48,11.66 11.75,11.66 13.02,11.66 14.29,11.66 23.02,11.19 23.97,13.73 25.56,13.73 27.46,13.73 29.05,13.73 30.95,13.73 22.06,13.73 20.8,13.73 23.02,14.68 26.51,14.68 30,14.68 25.56,14.68 27.46,14.68 29.05,14.68 30.95,14.68 23.97,14.68 22.06,14.68 22.06,11.19 20.8,11.19 26.51,11.19 29.05,11.19 30,11.19 30.95,11.19 31.59,9.6 31.59,10.55 33.5,9.6 33.5,10.55 33.5,11.5 32.86,12.46 31.91,13.09 27.78,11.19 23.97,9.92 25.56,9.92 27.14,10.23 28.41,10.23 30.32,9.92 22.38,9.92 21.11,9.92 13.81,15.16 15.4,15.16 23.02,15.95 26.51,15.95 30,15.95 19.84,15.95 15.4,16.27 12.54,16.27 9.68,16.27 9.21,10.08 23.97,7.38 23.97,4.84 17.62,3.57 22.54,69.13 0.79,37.7 13.81,42.62 21.43,51.51 8.73,42.62 7.46,62.94 1.11,62.94 30.32,60.4 30.32,50.24 30.32,79.45 51.91,51.51 67.15,47.7 59.61,47.54 56.99,1.98 20.16,62.94 58.02,47.54 51.12,47.22 28.26,32.78 20.8,28.02 26.35,22.46 49.69,31.19 49.69,28.65 51.12,24.36 52.07,19.76 42.07,22.14 43.34,26.9 44.13,31.98 49.37,35.32 47.31,18.33 59.37,26.27 56.04,23.25 56.04,28.65 56.51,19.44 48.89,11.5 51.43,10.39 67.94,31.82 17.78,21.66
  pour GND: -0.16,-0.08 -0.16,85.16 80.17,85.16 80.17,-0.08
  pour Top (rank 2): 0,85.16 80.33,85.16 80.33,-0.24 0,-0.24
  pour Top (no thermals): 15.56,13.73 15.56,10.55 19.37,10.55 19.37,13.73
  pour Top (no thermals): 30.8,8.49 34.92,8.49 34.92,4.36 30.8,4.36
  pour Top (no thermals): 22.22,70.72 22.86,70.72 22.86,68.81 22.22,68.81
  pour Bottom: 80.33,85.32 80.33,-0.4 6.03,-0.4 -0.48,-0.4 -0.48,8.17 -0.48,85.32
IDD0  (via drill 0.3)
  Top 0.152: IC1.87 52.86,40.72 v53.5,41.35 | v32.38,73.97 32.35,74 IDD.B2 IDD.A2
  Bottom 0.152: v53.5,41.35 53.5,43.41 34.92,61.99 34.92,71.42 v32.38,73.97
IDD1  (via drill 0.3)
  Top 0.152: IC1.88 52.37,37.84 52.55,38.02 52.55,41.67 v52.86,41.98 | v32.54,73.01 31.34,73.01 IDD.B3 IDD.A3
  Bottom 0.152: v52.86,41.98 52.86,43.57 34.61,61.83 34.61,70.95 32.94,72.62 v32.54,73.01
IDD2  (via drill 0.3)
  Top 0.152: IC1.89 51.87,37.81 52.23,38.17 v52.23,42.62 | v32.54,72.06 32.48,72 IDD.B4 IDD.A4
  Bottom 0.152: v52.23,42.62 52.23,43.73 34.29,61.67 34.29,70.31 33.1,71.5 v32.54,72.06
IDD3  (via drill 0.3)
  Top 0.152: IC1.90 51.37,37.78 51.91,38.32 51.91,40.56 51.59,40.87 v51.59,43.26 | v32.54,70.95 32.49,71 IDD.B5 IDD.A5
  Bottom 0.152: v51.59,43.26 51.59,43.89 33.97,61.51 33.97,69.52 v32.54,70.95
IDD4  (via drill 0.3)
  Top 0.152: IC1.91 50.87,37.71 51.59,38.43 51.59,40.4 50.96,41.03 v50.96,42.62 | v32.54,70 IDD.B6 IDD.A6
  Bottom 0.152: v50.96,42.62 50.96,44.05 33.65,61.35 33.65,68.88 v32.54,70
IDD5  (via drill 0.3)
  Top 0.152: IC1.92 50.37,37.9 50.56,38.1 50.83,38.1 51.27,38.54 51.27,40.24 50.32,41.19 v50.32,41.98 | v32.54,69.04 32.5,69 IDD.B7 IDD.A7
  Bottom 0.152: v50.32,41.98 50.32,42.94 50.32,44.21 33.34,61.19 33.34,68.25 v32.54,69.04
IDD6  (via drill 0.3)
  Top 0.152: IC1.93 49.87,38.2 50.07,38.4 50.7,38.4 50.96,38.65 50.96,40.08 v49.69,41.35 | v32.54,67.93 32.48,68 IDD.B8 IDD.A8
  Bottom 0.152: v49.69,41.35 49.69,44.37 33.02,61.03 33.02,67.46 v32.54,67.93
IMU-CS  (via drill 0.3)
  Top 0.152: IC1.137 37.93,21.18 36.83,20.08 v36.83,17.86 | RN6.1 15.96,37.94 17.14,36.75 17.14,29.92 v16.98,29.76
  Bottom 0.152: v36.83,17.86 27.3,17.86 19.84,25.32 19.84,26.59 17.62,28.81 17.62,29.13 v16.98,29.76
IMU-INT  (via drill 0.3)
  Top 0.152: v19.21,25.79 19.84,25.16 19.84,24.68 23.97,20.55 32.38,20.55 36.51,16.43 41.59,16.43 42.07,16.9 43.02,16.9 43.37,16.56 IC1.3 | v16.19,29.44 16.19,31.19 15.32,32.06 RN12.4
  Bottom 0.152: v19.21,25.79 19.21,26.59 16.35,29.44 v16.19,29.44
KICK-CHG
  Top 0.152: IC1.126 39.59,26.68 39.53,26.74 36.19,26.74 33.97,28.97 33.97,37.22 33.02,38.17 33.02,41.83 25.88,48.97 25.88,62.78 20.25,68.41 PWR.35
KICK-CS
  Top 0.152: PWR.31 18.25,68.5 24.61,62.15 24.61,48.34 31.43,41.51 31.43,37.06 33.5,35 33.5,30.71 33.5,28.97 36.03,26.43 39.37,26.43 39.62,26.18 IC1.127
KICK-ERR
  Top 0.152: PWR.38 21.75,68.34 26.83,63.26 26.83,49.45 33.97,42.3 33.97,38.65 35.88,36.75 35.88,27.54 36.35,27.06 39.53,27.06 39.64,27.18 IC1.125
KILL  (via drill 0.3)
  Top 0.152: IC1.122 39.71,28.68 39.37,28.33 39.37,27.86 39.21,27.7 37.46,27.7 36.83,28.33 v36.83,30.4 | PWR.17 11.25,69.31 16.51,64.05 16.51,50.24 24.13,42.62 v24.13,36.27
  Bottom 0.152: v36.83,30.4 36.67,30.4 30.8,36.27 v24.13,36.27
LCD-ON  (via drill 0.3)
  Top 0.152: IC1.55 60.71,26.68 59.21,28.17 v59.21,32.94 | RN4.5 67.71,54.45 v67.63,54.37
  Bottom 0.152: v59.21,32.94 62.7,36.43 62.7,50.56 66.52,54.37 v67.63,54.37
LCD-RESET  (via drill 0.3)
  Top 0.152: IC1.57 60.98,27.68 60.48,28.17 v60.48,32.94 | RN4.8 68.18,52.7 v67.63,52.14
  Bottom 0.152: v60.48,32.94 60.48,33.09 63.34,35.95 63.34,50.24 65.25,52.14 v67.63,52.14
LED1  (via drill 0.3)
  Top 0.152: IC1.26 54.87,17.6 v54.77,17.7 | v46.2,3.73 46.2,1.5 45.4,0.71 LED1.C
  Bottom 0.152: v46.2,3.73 46.83,4.36 53.81,4.36 54.77,5.31 v54.77,17.7
LED2  (via drill 0.3)
  Top 0.152: IC1.29 56.37,16.6 v56.83,17.06 | LED2.C 49.21,0.71 49.85,1.34 49.85,3.25 v50.32,3.73
  Bottom 0.152: v56.83,17.06 55.09,15.32 55.09,5.16 53.66,3.73 v50.32,3.73
MAG-CS  (via drill 0.3)
  Top 0.152: IC1.7 45.37,14.87 45.72,14.52 45.72,12.46 45.4,12.14 42.86,12.14 39.84,15.16 35.88,15.16 31.75,19.28 23.34,19.28 20.48,22.14 v18.89,22.14 | RN7.2 17.23,24.59 v17.3,24.52
  Bottom 0.152: v17.3,24.52 17.3,23.25 18.41,22.14 v18.89,22.14
MAG-DRDY
  Top 0.152: IC1.8 45.87,14.85 46.04,14.68 46.04,12.3 45.56,11.82 42.7,11.82 39.69,14.84 35.72,14.84 31.59,18.97 23.18,18.97 20.64,21.51 18.73,21.51 17.38,22.86 RN8.4
MAG-INT
  Top 0.152: IC1.9 46.35,15.79 46.35,12.14 45.72,11.5 42.54,11.5 39.53,14.52 35.56,14.52 31.43,18.65 23.02,18.65 20.56,21.11 RN8.1
N$1
  Top 0.152: IC8.10 12.77,24.59 RN7.7
N$2
  Top 0.152: IC8.1 11.1,24.42 11.1,24.59 12.22,25.71 RN7.5
N$3
  Top 0.152: IC8.11 12.1,24.42 12.1,24.59 12.6,25.09 RN7.6
N$4
  Top 0.152: IC8.9 13.43,23.82 13.57,23.96 RN7.8
N$5
  Top 0.152: IC8.7 13.29,22.82 15,21.11 RN8.8
N$6
  Top 0.152: IC8.8 13.43,23.32 13.89,22.86 RN8.5
N$7
  Top 0.152: C29.1 10.74,22.56 IC8.4
N$8
  Top 0.152: C31.1 11.5,20.84 IC8.5
  Top 0.406: L4.1 9.91,20.68 C32.1 C31.1
N$9
  Top 0.152: R1.1 43.28,0.77 LED1.A
N$10
  Top 0.152: R2.1 47.19,2.04 LED2.A
N$11
  Top 0.152: IC7.12 12.32,33 13.25,32.06 RN12.5
N$12
  cutout Top: 20.16,13.09 30.64,13.09 30.64,11.82 26.03,11.82 26.03,10.39 23.49,10.39 23.49,11.82 20.16,11.82
N$13
  cutout Top: 7.78,12.14 7.78,13.73 14.76,13.73 14.76,12.14
N$107
  Top 0.61: R11.2 8.12,52.7 | 8.12,52.7 IC12.1 | C59.1 9.55,52.7 8.12,52.7
N$108
  Top 0.152: LED4.A 29.74,83.64 R10.1
N$111
  Top 0.61: L8.2 2.44,57.19 C56.1 2.57,56.72 3.01,56.27 3.01,55.11 C57.1 1.66,53.54 IC12.3
N$124
  Top 0.152: IC1.23 53.37,14.91 53.08,14.62 53.08,12.79 Q1.3
N$125
  Top 0.152: IC1.106 43.37,38.05 43.5,38.17 43.5,39.55 C5.1
N$126
  Top 0.152: IC1.71 63.71,34.68 C4.1
N$127
  Top 0.406: L1.1 68.19,43.95 C19.1 69.59,43.73 74.77,43.73 76.07,42.43 IC3.29
N$128
  Top 0.152: RN4.1 69.61,52.59 IC3.38
N$129
  Top 0.152: RN4.4 70.41,54.45 71.09,55.13 IC3.40
N$130
  Top 0.152: RN1.2 69.62,9.67 70.01,9.28 70.01,8.81 70.64,8.17 74.77,8.17 76.07,6.87 IC3.1
N$131
  Top 0.152: RN4.3 74.86,53.82 76.17,55.13 IC3.39
N$132
  Top 0.152: RN1.4 69.43,10.71 74.93,10.71 76.17,11.95 IC3.5
N$133
  Top 0.152: RN1.1 70.48,7.91 70.48,7.54 71.15,6.87 IC3.2
N$134
  Top 0.152: RN1.3 70.39,10.17 71.15,9.41 IC3.4
N$135
  Top 0.152: SD.8 56.9,59.5 RN2.7
N$136
  Top 0.152: SD.7 55.05,59.48 56.27,58.26 RN2.8
N$137
  Top 0.152: SD.5 50.12,59.8 49.05,60.88 44.29,60.88 43.81,60.4 43.81,58.65 42.84,57.67 RN3.5
N$138
  Top 0.152: SD.2 42.62,59.37 41.75,58.5 41.11,58.5 40.73,58.11 RN3.6
N$139
  Top 0.152: SD.9 37.62,59.45 39.39,57.67 RN3.8
N$140
  Top 0.152: SD.1 40.23,59.55 RN3.7
N$141
  Top 0.152: SD.CD 58.05,59.24 57.4,58.59 RN2.6
N$142
  Top 0.152: SD.WP 59.25,59.17 58.02,57.94 RN2.5
N$143
  Top 0.406: IC2.5 48.79,55 C21.1 C20.1 51.98,55.42 L2.1
N$145
  Top 0.406: IC6.1 66.04,64.37 66.17,64.5 USB.1
N$146
  Top 0.152: USB.2 65.18,67 64.22,66.04 RN5.5
N$147
  Top 0.152: USB.3 65.11,69 62.47,66.35 RN5.8
N$148
  Top 0.152: IC7.9 9.75,30.65 10,30.4 13.75,30.4 RN12.8
N$149
  Top 0.152: IC7.10 10.25,32.53 10.63,32.14 C25.1
N$150
  Top 0.152: IC7.13 13.25,33.75 C27.1 C28.1 16.1,34.15 L3.1
N$151
  Top 0.152: IC7.24 8.75,37.88 9.93,39.06 RN6.6
N$152
  Top 0.152: IC7.23 9.25,37.58 10.23,38.56 RN6.7
N$153
  Top 0.152: IC7.22 9.75,37.66 10.03,37.94 RN6.8
N$156
  Top 0.152: LED3.A R9.1
N$157
  Top 0.406: IC11.1 13.17,5.05 C54.1 12.98,5.24 L7.1
N$159  (via drill 0.3)
  Top 0.152: IC10.17 35.52,7.18 v35.88,7.54 | RN9.8 37.86,10.47 v37.62,10.23
  Bottom 0.152: v37.62,10.23 37.62,9.28 v35.88,7.54
N$160  (via drill 0.3)
  Top 0.152: IC10.16 35.81,6.68 v35.88,6.74 | RN9.7 37.69,11.1 v37.62,11.03
  Bottom 0.152: v35.88,6.74 35.24,7.38 35.24,7.7 36.99,9.44 36.99,10.39 v37.62,11.03
N$161  (via drill 0.3)
  Top 0.152: IC10.18 35.06,7.68 35.4,8.01 v35.4,8.81 | RN9.6 37.85,11.6 v37.62,11.82
  Bottom 0.152: v37.62,11.82 36.51,10.71 36.51,9.92 v35.4,8.81
N$162  (via drill 0.3)
  Top 0.152: IC10.19 34.11,8.95 v34.45,9.28 | RN9.5 38.02,12.22 v37.62,12.62
  Bottom 0.152: v37.62,12.62 34.45,9.44 v34.45,9.28
N$163  (via drill 0.3)
  Top 0.152: IC10.7 31.61,4.22 31.27,3.89 v30.8,3.89 | RN10.5 38.81,9.2 v38.73,9.28
  Bottom 0.152: v30.8,3.89 31.27,3.89 32.54,5.16 35.72,5.16 38.73,8.17 v38.73,9.28
N$164  (via drill 0.3)
  Top 0.152: IC10.8 32.11,3.93 v31.59,3.41 | RN10.8 38.81,7.45 v38.73,7.38
  Bottom 0.152: v31.59,3.41 33.02,4.84 36.19,4.84 v38.73,7.38
N$165
  Top 0.152: IC10.4 30.39,6.18 30.16,5.95 28.53,5.95 Q2.3
N$166
  Top 0.152: IC10.6 30.66,5.18 30.32,4.84 30.32,4.2 30.16,4.04 30.16,3.68 Q2.1
N$167  (via drill 0.3)
  Top 0.152: v29.84,7.18 IC10.2 v29.84,7.18 | v29.84,7.18 29.15,7.18 C46.1 | IC10.12 34.11,4.22 34.61,3.73 v35.08,3.73 35.08,2.99 C45.1
  Bottom 0.152: v35.08,3.73 32.86,3.73 31.91,2.77 31.11,2.77 30.16,3.73 30.16,6.86 v29.84,7.18
N$168
  Top 0.152: IC10.1 30.18,7.68 29.05,8.81 C53.1
N$169
  Top 0.305: IC9.21 20.55,12.39 C38.2
N$170
  Top 0.643: C33.1 25.41,12.31 R7.1 26.5,12.46 C41.1 27.74,12.44 R6.2
N$171
  Top 0.643: C38.1 23,12.46 C42.1 24.25,12.44 | 24.25,12.44 R7.2 | C33.2 24.11,12.31 24.25,12.44
N$172
  Top 0.356: IC10.22 32.61,9.14
  Top 0.643: 30.02,12.46 30.8,12.46 arc-90 32.61,10.64 32.61,9.14 | 30.02,12.46 arc90 C40.1 | R6.1 30.02,12.46
N$174
  Top 0.305: IC9.8 14.19,12.89 C39.1
N$175
  Top 0.643: C39.2 12.83,12.92 C43.1 10.52,12.92 R8.1
N$176
  Top 0.643: ANT.C 4.08,12.92 C44.1 8.43,12.93 R8.2
NOMAG
  cutout Top: 6.19,28.17 16.98,28.17 16.98,18.65 6.19,18.65
  cutout Bottom: 6.19,28.17 16.98,28.17 16.98,18.65 6.19,18.65
  cutout GND: 6.19,28.17 16.98,28.17 16.98,18.65 6.19,18.65
  cutout PWR: 6.19,28.17 16.98,28.17 16.98,18.65 6.19,18.65
OTG-FS-DM
  Top 0.152: IC1.103 44.87,37.8 46.75,39.68 46.83,39.76 46.83,40.87 60.8,54.84 60.8,58.18 64.22,61.59 RN5.4
OTG-FS-DP
  Top 0.152: IC1.104 44.37,37.83 46.51,39.97 46.51,41.03 60.32,54.84 60.32,58.34 62.47,60.48 RN5.1
PDN  (via drill 0.3)
  Top 0.152: IC1.117 38.43,31.18 v38.26,31.35 | PWR.19 12.25,68.79 16.83,64.21 16.83,50.4 24.76,42.46 v24.76,36.91
  Bottom 0.152: v38.26,31.35 36.99,32.62 34.92,32.62 30.64,36.91 v24.76,36.91
SD-CD  (via drill 0.3)
  Top 0.152: IC1.49 60.85,23.68 57.94,26.59 57.94,31.03 v56.99,31.98 | RN2.3 57.4,55.86 v57.47,55.8
  Bottom 0.152: v56.99,31.98 57.31,32.3 57.31,55.64 v57.47,55.8
SD-PWR  (via drill 0.3)
  Top 0.152: IC1.80 56.35,37.06 56.35,40.24 v55.24,41.35 | v45.72,53.73 IC2.4
  Top 0.406: R3.1 45.3,55.42 IC2.4
  Bottom 0.152: v55.24,41.35 55.24,44.21 v45.72,53.73
SD-WP  (via drill 0.3)
  Top 0.152: IC1.73 59.87,38.16 v59.53,38.49 | RN2.4 58.08,56.77 v58.74,56.11
  Bottom 0.152: v59.53,38.49 58.74,39.29 v58.74,56.11
SD_PWR
  Top 0.406: IC2.1 SD.4
SDMMC1-CK  (via drill 0.3)
  Top 0.152: IC1.113 39.76,33.18 37.3,35.63 v37.3,36.91 | v39.37,52.78 41.36,54.77 RN3.4
  Bottom 0.152: v37.3,36.91 37.3,41.03 35.08,43.26 35.08,51.03 36.83,52.78 v39.37,52.78
SDMMC1-CMD  (via drill 0.3)
  Top 0.152: IC1.116 39.67,31.68 36.67,34.68 v36.67,37.54 | v39.37,53.57 40.73,54.94 RN3.3
  Bottom 0.152: v36.67,37.54 36.67,41.03 34.77,42.94 34.77,51.19 37.15,53.57 v39.37,53.57
SDMMC1-D0  (via drill 0.3)
  Top 0.152: IC1.98 47.37,37.92 47.47,38.02 47.47,40.24 55.4,48.18 v55.72,48.18 | RN2.1 56.27,56.67 v55.72,56.11
  Bottom 0.152: v55.72,48.18 v55.72,56.11
SDMMC1-D1  (via drill 0.3)
  Top 0.152: IC1.99 46.87,37.89 47.15,38.17 47.15,40.4 49.77,43.02 v56.51,49.76 | RN2.2 56.9,56.34 56.51,55.95 v56.51,55.8
  Bottom 0.152: v56.51,49.76 v56.51,55.8
SDMMC1-D2  (via drill 0.3)
  Top 0.152: IC1.111 39.72,34.18 38.58,35.32 v38.58,36.91 | RN3.1 39.61,55.08 38.1,53.57 v38.1,51.51
  Bottom 0.152: v38.58,36.91 38.58,40.72 35.72,43.57 35.72,49.76 37.46,51.51 v38.1,51.51
SDMMC1-D3  (via drill 0.3)
  Top 0.152: IC1.112 39.74,33.68 37.94,35.48 v37.94,37.54 | RN3.2 40.23,55.23 38.73,53.73 v38.73,52.14
  Bottom 0.152: v37.94,37.54 37.94,40.87 35.4,43.41 35.4,46.59 35.41,46.6 35.41,50.41 37.15,52.14 v38.73,52.14
SMB-ALRT  (via drill 0.3)
  Top 0.152: IC1.12 47.87,16.66 44.77,19.76 v43.97,19.76 | v31.43,26.64 29.95,26.64 22.22,34.37 22.22,42.62 15.24,49.61 15.24,63.42 9.25,69.41 PWR.13
  Bottom 0.152: v43.97,19.76 42.54,19.76 41.91,19.12 36.03,19.12 31.43,23.73 v31.43,26.64
SMB-RST
  Top 0.152: IC1.128 39.64,25.68 39.21,26.11 30,26.11 21.91,34.21 21.91,42.46 14.92,49.45 14.92,63.26 8.75,69.43 PWR.12
SMB-SCL  (via drill 0.3)
  Top 0.152: IC1.11 47.31,15.86 47.31,16.74 44.92,19.12 v43.34,19.12 | PWR.15 10.25,69.36 15.87,63.73 15.87,49.92 22.86,42.94 22.86,34.68 29.53,28.02 v30.8,28.02
  Bottom 0.152: v43.34,19.12 42.38,19.12 42.07,18.81 35.88,18.81 30.8,23.89 v30.8,28.02
SMB-SDA  (via drill 0.3)
  Top 0.152: IC1.10 46.83,15.84 46.83,16.74 45.08,18.49 v42.7,18.49 | PWR.14 9.75,69.38 15.56,63.58 15.56,49.76 22.54,42.78 22.54,34.52 29.84,27.22 v30.16,27.22
  Bottom 0.152: v42.7,18.49 35.72,18.49 30.16,24.05 v30.16,27.22
SPI1-MISO
  Top 0.152: IC1.42 62.49,20.18 62.55,20.24 64.77,20.24 65.88,19.12 65.88,14.68 60.01,8.81 42.38,8.81 40.09,11.1 RN9.2
SPI1-MOSI
  Top 0.152: IC1.43 62.51,20.68 62.63,20.55 64.93,20.55 66.2,19.28 66.2,14.52 60.16,8.49 42.23,8.49 40.24,10.47 RN9.1
SPI1-SCK
  Top 0.152: IC1.41 62.46,19.68 62.7,19.92 64.61,19.92 65.56,18.97 65.56,14.84 59.85,9.12 42.54,9.12 40.07,11.6 RN9.3
SPI2-MISO  (via drill 0.3)
  Top 0.152: IC1.75 58.87,36.08 57.31,34.52 v56.67,34.52 | v32.7,36.75 32.7,37.54 32.38,37.86 32.38,41.51 25.24,48.65 25.24,62.46 19.25,68.45 PWR.33
  Bottom 0.152: v56.67,34.52 55.88,34.52 55.24,33.89 36.83,33.89 33.97,36.75 v32.7,36.75
SPI2-MOSI  (via drill 0.3)
  Top 0.152: IC1.76 58.37,36.06 57.78,35.48 v56.67,35.48 | PWR.32 18.75,68.48 24.92,62.3 24.92,48.49 32.07,41.35 v32.07,37.38
  Bottom 0.152: v56.67,35.48 56.35,35.48 55.09,34.21 43.81,34.21 36.99,34.21 33.81,37.38 v32.07,37.38
SPI2-SCK  (via drill 0.3)
  Top 0.152: IC1.74 59.37,36.11 57.15,33.89 v56.04,33.89 | v33.34,36.11 33.34,37.38 32.7,38.02 32.7,41.67 25.56,48.81 25.56,62.62 19.75,68.43 PWR.34
  Bottom 0.152: v56.04,33.89 55.72,33.57 36.67,33.57 34.13,36.11 v33.34,36.11
SPI4-MISO  (via drill 0.3)
  Top 0.152: v44.77,17.86 43.87,16.95 IC1.4 43.87,15.05 43.66,14.84 41.91,14.84 40.96,15.79 36.19,15.79 32.07,19.92 23.65,19.92 19.68,23.89 18.57,23.89 | v45.4,6.11 45.88,6.58 53.66,6.58 61.07,6.58 63.53,9.04 RN1.8 | v18.57,30.4 18.57,23.89 | RN7.1 16.4,23.89 18.57,23.89 | v15.56,30.4 14.82,30.4 RN12.1
  Bottom 0.152: v44.77,17.86 45.45,17.17 45.45,12.56 45.4,12.5 v45.4,6.11 | v18.57,30.4 v15.56,30.4
SPI4-MOSI  (via drill 0.3)
  Top 0.152: v44.77,17.06 44.37,16.66 IC1.5 44.37,14.8 44.09,14.52 41.75,14.52 40.8,15.47 36.03,15.47 31.91,19.6 23.49,19.6 20,23.09 v19.21,23.09 | v44.29,6.11 45.08,6.9 60.96,6.9 64.22,10.17 RN1.6 | RN6.3 16.42,39.06 17.94,37.54 v17.94,25.16 16.83,25.16 16.76,25.09 RN7.3
  Bottom 0.152: v44.77,17.06 44.29,16.59 v44.29,6.11 | v19.21,23.09 17.94,24.36 v17.94,25.16
SPI4-SCK  (via drill 0.3)
  Top 0.152: IC1.1 41.76,15.8 v41.75,15.79 41.43,16.11 36.35,16.11 32.23,20.24 23.81,20.24 v19.21,24.84 | v43.66,6.74 44.13,7.22 60.8,7.22 64.37,10.79 RN1.5 | RN6.2 16.44,38.56 17.62,37.38 17.62,26.11 v17.3,25.79 16.4,25.79 RN7.4
  Bottom 0.152: v41.75,15.79 43.66,13.89 43.66,12.14 v43.66,6.74 | v17.3,25.79 18.26,25.79 v19.21,24.84
SRST  (via drill 0.3)
  Top 0.152: C2.1 54.37,14.49 IC1.25 54.37,16.99 v53.66,17.7 53.18,18.17 50.48,18.17 47.78,20.87 v47.78,24.36 | SW1.1 51.91,5.47 v53.66,5.47 60.9,5.47 SW1.2 | PWR.28 16.75,68.57 23.65,61.67 23.65,47.86 29.53,41.98 29.53,36.59 v32.86,33.25
  Bottom 0.152: v53.66,17.7 v53.66,5.47 | v47.78,24.36 42.86,24.36 38.1,29.13 35.56,29.13 33.97,30.71 33.97,32.14 v32.86,33.25
SWCLK  (via drill 0.3)
  Top 0.152: IC1.109 40.49,35.94 37.62,38.81 v34.61,38.81 | PWR.26 15.75,68.62 19.05,65.32 19.05,51.51 28.26,42.3 v28.26,38.81
  Bottom 0.152: v34.61,38.81 v28.26,38.81
SWDIO  (via drill 0.3)
  Top 0.152: IC1.105 43.87,36.32 43.66,36.11 42.08,36.11 36.84,41.35 v34.61,41.35 | PWR.27 16.25,68.6 23.34,61.51 23.34,47.7 28.89,42.14 v28.89,41.35
  Bottom 0.152: v34.61,41.35 v28.89,41.35
TIM1-CH1  (via drill 0.3)
  Top 0.152: IC1.100 46.37,35.97 46.2,35.79 45.88,35.48 44.45,35.48 44.13,35.16 41.75,35.16 37.46,39.45 v35.24,39.45 | PWR.16 10.75,69.33 16.19,63.89 16.19,50.08 23.49,42.78 v23.49,39.45
  Bottom 0.152: v35.24,39.45 v23.49,39.45
TIM3-CH1  (via drill 0.3)
  Top 0.152: IC1.96 48.37,35.9 v47.47,35 | LEDS.2 37.46,44.96 v37.46,43.73
  Bottom 0.152: v47.47,35 46.83,35.63 46.83,40.24 46.04,41.03 40.16,41.03 v37.46,43.73
TIM3-CH2  (via drill 0.3)
  Top 0.152: IC1.97 47.87,36.2 v47.47,35.79 | LEDS.3 v38.5,43.74 v38.5,43.73
  Bottom 0.152: v47.47,35.79 47.15,36.11 47.15,40.4 46.2,41.35 40.88,41.35 v38.5,43.73
TIM3-CH3  (via drill 0.3)
  Top 0.152: IC1.46 60.92,22.18 60.8,22.3 57.62,22.3 56.69,23.24 56.69,29.75 v51.43,35 | LEDS.4 39.53,44.97 v39.53,43.73
  Bottom 0.152: v51.43,35 47.47,38.97 47.47,40.56 46.35,41.67 41.59,41.67 40,43.26 v39.53,43.73
TIM3-CH4  (via drill 0.3)
  Top 0.152: IC1.47 61.68,22.62 57.78,22.62 56.99,23.41 56.99,29.92 52.7,34.21 v52.7,35 | LEDS.5 40.48,44.98 v40.48,43.73
  Bottom 0.152: v52.7,35 52.7,35.79 48.89,39.6 48.89,40.24 47.15,41.98 42.23,41.98 v40.48,43.73
TIM4-CH1  (via drill 0.3)
  Top 0.152: IC1.81 55.87,36.1 v54.61,34.84 | LEDS.6 41.5,43.74 v41.51,43.73
  Bottom 0.152: v54.61,34.84 53.81,35.63 53.34,35.63 49.21,39.76 49.21,40.4 47.31,42.3 42.94,42.3 v41.51,43.73
TIM4-CH2  (via drill 0.3)
  Top 0.152: IC1.82 55.37,36.23 54.77,35.63 v54.61,35.63 | LEDS.7 42.5,43.77 v42.54,43.73
  Bottom 0.152: v54.61,35.63 54.29,35.95 53.5,35.95 49.53,39.92 49.53,40.56 47.47,42.62 43.66,42.62 v42.54,43.73
TIM4-CH3  (via drill 0.3)
  Top 0.152: IC1.139 41.53,20.18 45.4,24.05 v45.4,34.84 | v44.61,38.97 45.08,39.45 45.08,41.83 43.5,43.41 LEDS.8
  Bottom 0.152: v44.61,38.97 45.4,38.17 v45.4,34.84
TIM4-CH4  (via drill 0.3)
  Top 0.152: IC1.140 41.67,19.68 45.72,23.73 45.72,34.37 v46.2,34.84 | v45.88,40.24 45.88,41.51 44.5,42.89 LEDS.9
  Bottom 0.152: v46.2,34.84 46.2,39.92 v45.88,40.24
TIM13-CH1  (via drill 0.3)
  Top 0.152: IC1.20 51.87,16.95 51.27,17.54 50.16,17.54 46.51,21.19 v46.51,25.79 | v34.61,30.87 34.61,37.06 33.34,38.33 33.34,41.98 26.19,49.13 26.19,62.94 20.75,68.38 PWR.36
  Bottom 0.152: v46.51,25.79 42.38,25.79 38.42,29.76 36.51,29.76 35.4,30.87 v34.61,30.87
TIM14-CH1  (via drill 0.3)
  Top 0.152: IC1.21 52.37,17.08 51.59,17.86 50.32,17.86 47.15,21.03 v47.15,25 | v35.24,30.24 35.24,36.91 33.65,38.49 33.65,42.14 26.51,49.29 26.51,63.1 21.25,68.36 PWR.37
  Bottom 0.152: v47.15,25 42.7,25 38.26,29.44 36.35,29.44 35.56,30.24 v35.24,30.24
TP-CS  (via drill 0.3)
  Top 0.152: IC1.56 60.84,27.18 59.85,28.17 v59.85,32.3 | RN4.6 68.19,53.82 v67.63,53.26
  Bottom 0.152: v59.85,32.3 59.85,33.09 63.02,36.27 63.02,50.4 65.88,53.26 v67.63,53.26
TP-IRQ  (via drill 0.3)
  Top 0.152: IC1.40 60.75,19.18 60.64,19.28 v60.48,19.28 | v67.63,9.6 67.69,9.67 RN1.7
  Bottom 0.152: v60.48,19.28 60.48,16.27 67.15,9.6 v67.63,9.6
UART4-RX  (via drill 0.3)
  Top 0.152: IC1.35 59.37,18.18 58.26,19.28 v58.26,20.08 | v35.56,22.62 34.13,24.05 30.64,24.05 20.95,33.73 20.95,41.98 13.97,48.97 13.97,62.78 7.25,69.5 PWR.9
  Bottom 0.152: v58.26,20.08 56.67,21.66 46.2,21.66 44.45,23.41 39.05,23.41 37.94,22.3 37.62,22.3 36.67,23.25 36.19,23.25 v35.56,22.62
UART4-TX  (via drill 0.3)
  Top 0.152: IC1.34 58.87,18.2 v57.62,19.44 | v36.51,22.62 34.77,24.36 30.8,24.36 21.27,33.89 21.27,42.14 14.29,49.13 14.29,62.94 7.75,69.48 PWR.10
  Bottom 0.152: v57.62,19.44 55.72,21.35 46.04,21.35 44.29,23.09 39.21,23.09 38.1,21.98 37.15,21.98 v36.51,22.62
UART5-RX
  Top 0.152: IC1.135 39.56,22.18 39.37,21.98 31.27,21.98 20,33.25 20,41.51 12.06,49.45 12.06,62.78 5.25,69.59 PWR.5
UART5-TX  (via drill 0.3)
  Top 0.152: IC1.136 40.48,21.66 31.11,21.66 19.68,33.09 19.68,40.56 12.7,47.54 v12.7,48.02 | PWR.6 5.75,69.57 12.7,62.62 v12.7,50.08
  Bottom 0.152: v12.7,48.02 v12.7,50.08
UART7-RX  (via drill 0.3)
  Top 0.152: v44.61,20.39 46.35,20.39 49.85,16.9 50.64,16.9 50.87,16.68 IC1.18 | v33.34,22.62 31.11,22.62 20.32,33.41 20.32,41.67 13.33,48.65 13.33,62.46 6.25,69.55 PWR.7
  Bottom 0.152: v44.61,20.39 35.56,20.39 v33.34,22.62
UART7-TX  (via drill 0.3)
  Top 0.152: v45.24,21.03 46.2,21.03 50.01,17.22 50.16,17.22 50.96,17.22 51.37,16.81 IC1.19 | v32.7,23.25 30.95,23.25 20.64,33.57 20.64,41.83 13.65,48.81 13.65,62.62 6.75,69.52 PWR.8
  Bottom 0.152: v45.24,21.03 44.29,21.03 43.97,20.71 36.19,20.71 33.65,23.25 v32.7,23.25
UART8-RX
  Top 0.152: IC1.141 41.22,19.18 41.91,18.49 41.91,17.38 41.27,16.74 36.67,16.74 32.54,20.87 30.95,20.87 19.05,32.78 19.05,40.24 11.43,47.86 11.43,62.46 4.25,69.64 PWR.3
UART8-TX
  Top 0.152: IC1.142 41.25,18.68 41.59,18.33 41.59,17.54 41.11,17.06 36.78,17.06 32.65,21.19 31.11,21.19 19.37,32.94 19.37,40.4 11.75,48.02 11.75,62.62 4.75,69.62 PWR.4
USART1-RX  (via drill 0.3)
  Top 0.152: IC1.102 45.37,36.23 45.24,36.11 44.13,36.11 43.81,35.79 41.97,35.79 37.05,40.72 v35.24,40.72 | PWR.30 17.75,68.53 24.29,61.99 24.29,48.18 30.8,41.67 v30.8,40.72
  Bottom 0.152: v35.24,40.72 v30.8,40.72
USART1-TX  (via drill 0.3)
  Top 0.152: IC1.101 45.87,36.1 45.56,35.79 44.29,35.79 43.97,35.48 41.86,35.48 37.26,40.08 v34.61,40.08 | PWR.29 17.25,68.55 23.97,61.83 23.97,48.02 30.16,41.83 v30.16,40.08
  Bottom 0.152: v34.61,40.08 v30.16,40.08
USART2-RX  (via drill 0.3)
  Top 0.152: IC1.37 60.82,17.68 59.53,18.97 v59.53,21.35 | PWR.23 14.25,68.69 18.1,64.84 18.1,51.03 26.99,42.14 26.99,37.38 32.07,32.3 32.07,30.55 32.7,29.92 32.7,28.49 33.97,27.22 v33.97,26.74
  Bottom 0.152: v59.53,21.35 58.58,22.3 46.51,22.3 44.77,24.05 36.67,24.05 v33.97,26.74
USART2-TX  (via drill 0.3)
  Top 0.152: IC1.36 59.87,18.15 58.9,19.12 v58.9,20.71 | PWR.22 13.75,68.72 17.78,64.69 17.78,50.88 26.67,41.98 26.67,37.22 31.75,32.14 31.75,30.4 32.38,29.76 32.38,28.33 33.02,27.7 v33.02,26.74
  Bottom 0.152: v58.9,20.71 57.62,21.98 46.35,21.98 44.61,23.73 36.03,23.73 v33.02,26.74
USART3-RX  (via drill 0.3)
  Top 0.152: IC1.70 59.02,34.18 58.1,33.25 v56.67,33.25 | PWR.21 13.25,68.78 17.46,64.57 17.46,50.72 26.03,42.14 v26.03,38.17
  Bottom 0.152: v56.67,33.25 55.88,33.25 35.24,33.25 30.32,38.17 v26.03,38.17
USART3-TX  (via drill 0.3)
  Top 0.152: IC1.69 59,33.68 57.94,32.62 v56.04,32.62 | PWR.20 12.75,68.76 17.14,64.37 17.14,50.56 25.4,42.3 v25.4,37.54
  Bottom 0.152: v56.04,32.62 55.72,32.94 35.08,32.94 30.48,37.54 v25.4,37.54
USART6-RX  (via drill 0.3)
  Top 0.152: IC1.124 39.67,27.68 39.37,27.38 36.83,27.38 v36.51,27.7 | PWR.24 14.75,68.67 18.41,65 18.41,51.19 27.3,42.3 27.3,37.54 32.63,32.22 v32.63,30.87
  Bottom 0.152: v36.51,27.7 33.34,30.87 v32.63,30.87
USART6-TX  (via drill 0.3)
  Top 0.152: IC1.129 39.66,25.18 39.05,25.79 37.15,25.79 v36.83,25.48 | PWR.25 15.25,68.64 18.73,65.16 18.73,51.35 27.62,42.46 27.62,37.7 33.18,32.14 33.18,28.49 v34.92,26.74
  Bottom 0.152: v36.83,25.48 36.19,25.48 v34.92,26.74
USB-ATT
  Top 0.152: IC1.132 39.64,23.68 39.37,23.41 39.37,22.46 39.21,22.3 38.58,22.3 37.62,22.3 35.24,24.68 30.95,24.68 21.59,34.05 21.59,42.3 14.6,49.29 14.6,63.1 8.25,69.45 PWR.11
USB-EN  (via drill 0.3)
  Top 0.152: IC1.54 60.57,26.18 58.58,28.17 v58.58,32.3 | v64.13,54.53 IC6.4
  Top 0.406: R4.2 63.71,56.22 IC6.4
  Bottom 0.152: v58.58,32.3 58.58,33.09 62.39,36.91 62.39,50.72 64.13,52.46 v64.13,54.53
WF-3V3  (via drill 0.3)
  Top 0.406: IC11.5 13.17,1.34 13.49,1.66 14.55,1.66 C55.1 14.98,1.66 v15.71,1.66 | v24.76,1.19 25.08,0.87 R9.2 | L6.1 14.76,5.92 v14.76,5.16 | v38.1,1.19 37.18,1.19 L5.1
  Bottom 0.406: v14.76,5.16 15.71,4.2 v15.71,1.66 18.73,1.66 19.52,0.87 24.45,0.87 v24.76,1.19 25.08,0.87 37.78,0.87 v38.1,1.19
WF-BUSY
  Top 0.152: IC1.44 62.56,21.18 62.86,20.87 65.04,20.87 66.52,19.39 66.52,14.36 60.32,8.17 42.07,8.17 41.03,9.2 RN10.4
WF-CPS
  Top 0.152: IC1.13 48.37,15.11 47.62,14.36 47.62,12.93 45.88,11.19 42.38,11.19 39.37,14.2 35.4,14.2 31.27,18.33 22.7,18.33 21.51,19.52 RN11.4
WF-CRX
  Top 0.152: IC1.14 48.87,15.13 47.94,14.2 47.94,12.77 46.04,10.87 42.23,10.87 39.21,13.89 35.24,13.89 32.78,16.35 31.11,18.01 22.06,18.01 21.68,18.4 RN11.2
WF-CS
  Top 0.152: IC1.22 52.87,14.84 52.23,14.2 52.23,12.93 49.53,10.23 41.91,10.23 39.92,12.22 RN9.4
WF-CTX
  Top 0.152: IC1.15 49.37,15.15 48.26,14.05 48.26,12.62 46.2,10.55 42.07,10.55 39.05,13.57 35.08,13.57 30.95,17.7 21.16,17.7 RN11.1
WF-IRQ
  Top 0.152: IC1.45 62.53,21.68 63.02,21.19 65.25,21.19 66.83,19.6 66.83,14.2 60.48,7.85 42.07,7.85 41.59,7.38 40.37,7.38 RN10.1
WF-ON  (via drill 0.3)
  Top 0.152: IC1.48 62.46,23.18 64.13,21.51 65.4,21.51 67.15,19.76 67.15,14.05 60.64,7.54 43.66,7.54 41.91,5.79 v41.91,1.5 | v11.27,2.46 IC11.3
  Bottom 0.152: v41.91,1.5 40.8,0.39 13.33,0.39 v11.27,2.46
WF_3V3FEM  (via drill 0.3)
  Top 0.152: IC9.16 17.96,10.01 17.99,9.98 17.99,9.33 C52.1 | IC9.14 16.96,10.01 16.93,9.98 16.93,9.49 C50.1 | IC9.19 19.96,11.39 v20,11.35 | IC9.3 17.96,14.34 v17.78,14.52
  Top 0.305: C48.1 14.45,10.61 15.23,11.39 IC9.11
  Top 0.406: L6.2 17.25,5.95 C51.1 C52.1 | L6.2 16.41,6.04 C49.1 C50.1 | L6.2 16.32,5.19 v16.35,5.16 | v10.79,10.55 11.69,10.55 C47.1 C48.1
  Bottom 0.152: v16.35,5.16 17.3,5.16 20,7.85 v20,11.35 18.89,11.35 17.78,12.46 v17.78,14.52
  Bottom 0.406: v16.35,5.16 15.24,6.27 13.97,6.27 13.02,7.22 13.02,8.33 v10.79,10.55
WF_3V3SX  (via drill 0.3)
  Top 0.152: IC10.3 30.25,6.68 29.84,6.27 v27.46,6.27
  Top 0.305: IC10.11 33.61,3.19 C35.1 C34.1 32.01,2.14 v31.75,2.14 | v38.1,2.77 37.18,2.77 L5.2 36.45,3.43 C36.1 C37.1 36.11,6.14 35.63,6.14 35.59,6.18 IC10.15
  Bottom 0.152: v27.46,6.27 27.46,5.79 31.11,2.14 v31.75,2.14
  Bottom 0.305: v31.75,2.14 37.46,2.14 v38.1,2.77

## Text on the board
tPlace: Design: A.Ryll | Mainboard v13 | TIGERs Mannheim